# Altium project OECU_BASE.PrjPcb
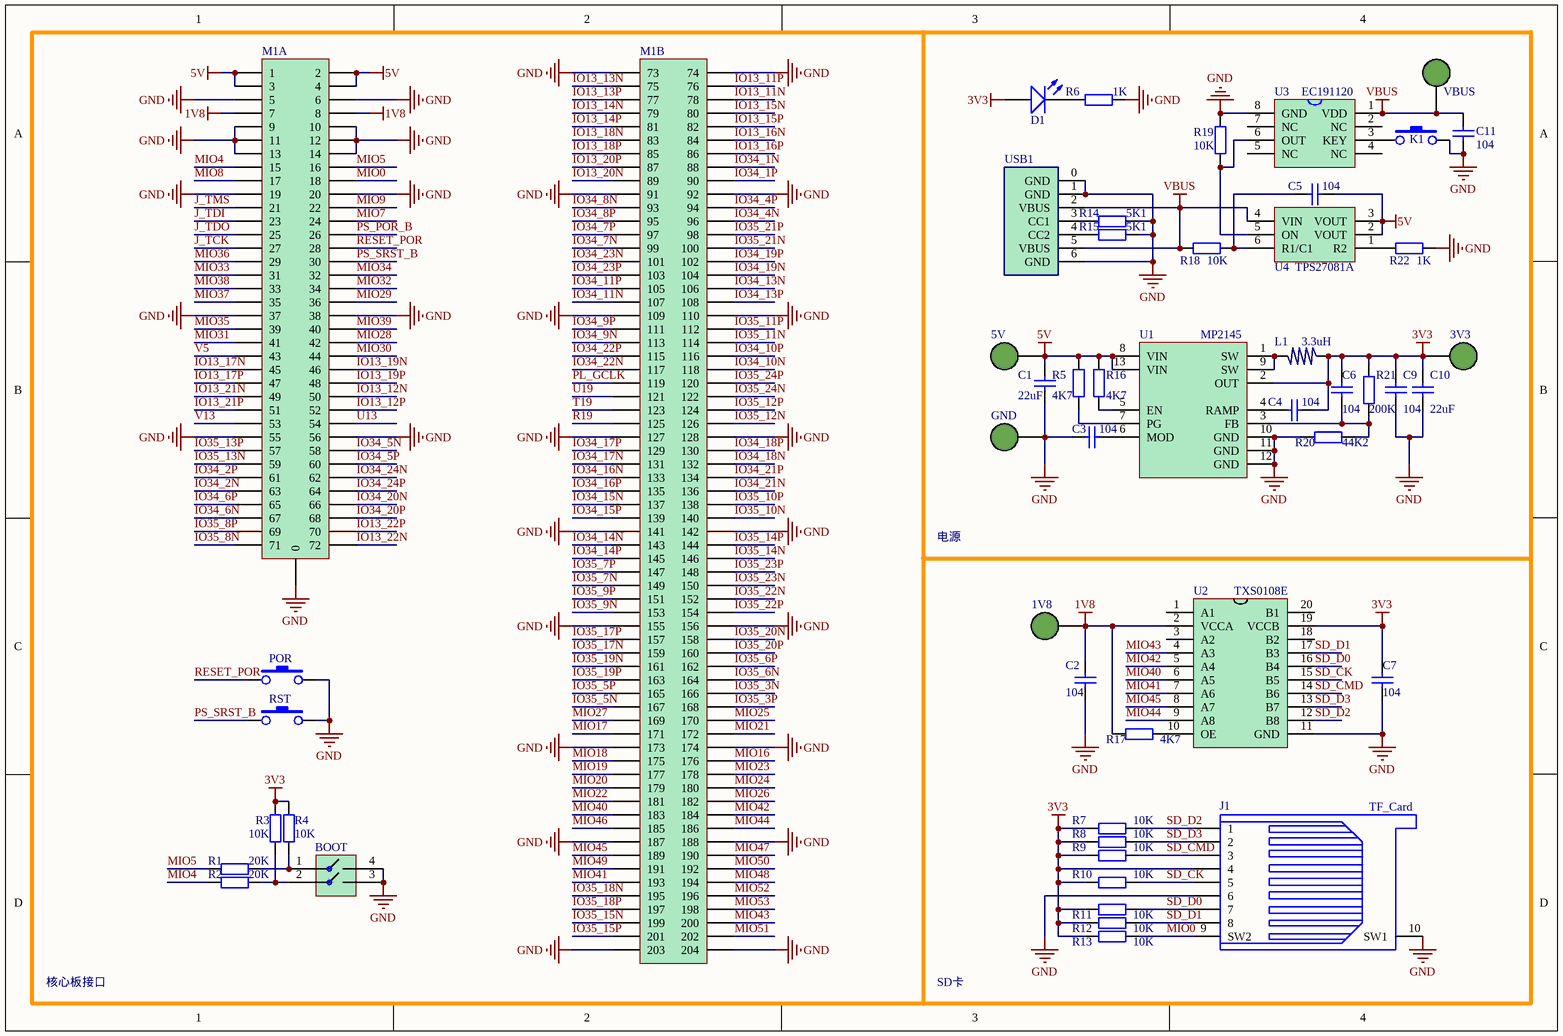
[diagram p0: OECU_BASE1.SchDoc]
6 sheets, 357 parts. Net scope: global (net labels, ports and power ports of the same name join across sheets).
Board file: OECU_BASE.PcbDoc
Sheets:
  OECU_BASE1.SchDoc
  OECU_BASE2.SchDoc
  OECU_BASE3.SchDoc
  OECU_BASE4.SchDoc
  OECU_BASE5.SchDoc
  OECU_BASE6.SchDoc

## Sheet OECU_BASE1.SchDoc
size A4; SheetNumber: 1; SheetTotal: 6

### Parts
1V8  TEST_POINT_2mm  [TEST_POINT_2mm]  (value not drawn)
3V3  TEST_POINT_2mm  [TEST_POINT_2mm]  (value not drawn)
5V  TEST_POINT_2mm  [TEST_POINT_2mm]  (value not drawn)
BOOT  DIP_SWITCH_2.54_2_SMD_S  [DIP_SWITCH_2.54_2_SMD_S]  (value not drawn)
C1  22uF  [1206]
C2  104  [0402]
C3  104  [0402]
C4  104  [0402]
C5  104  [0402]
C6  104  [0402]
C7  104  [0402]
C9  104  [0402]
C10  22uF  [1206]
C11  104  [0402]
D1  LED  [LED_0603]  (value not drawn)
GND  TEST_POINT_2mm  [TEST_POINT_2mm]  (value not drawn)
J1  TF_Card  [TF_card]
K1  KEY  [KEY_DIP_6_L]  (value not drawn)
L1  3.3uH  [L_0420]
M1  DDR3_204P_H8  [DDR3_204P_H8]  (value not drawn)  (parts A,B of 2)
POR  KEY  [KEY_DIP_6_L]  (value not drawn)
R1  20K  [R_0402]
R2  20K  [R_0402]
R3  10K  [R_0402]
R4  10K  [R_0402]
R5  4K7  [R_0402]
R6  1K  [R_0402]
R7  10K  [R_0402]
R8  10K  [R_0402]
R9  10K  [R_0402]
R10  10K  [R_0402]
R11  10K  [R_0402]
R12  10K  [R_0402]
R13  10K  [R_0402]
R14  5K1  [R_0402]
R15  5K1  [R_0402]
R16  4K7  [R_0402]
R17  4K7  [R_0402]
R18  10K  [R_0402]
R19  10K  [R_0402]
R20  44K2  [R_0402]
R21  200K  [R_0402]
R22  1K  [R_0402]
RST  KEY  [KEY_DIP_6_L]  (value not drawn)
U1  MP2145  [QFN12]
U2  TXS0108E  [TSSOP20]
U3  EC191120  [SOP8-150MIL]
U4  TPS27081A  [SOT_23_6]
USB1  USB_C_6P  [USB_C_6PIN]  (value not drawn)
VBUS  TEST_POINT_2mm  [TEST_POINT_2mm]  (value not drawn)

### Nets
1V8: 1V8.1 C2.2 M1.7 M1.8 R17.1 U2.2(VCCA)
3V3: 3V3.1 C4.2 C6.2 C7.2 C9.2 C10.2 D1.A J1.4 L1.1 R3.2 R4.2 R7.1 R8.1 R9.1 R10.1 R11.1 R12.1 R13.1 R21.2 U1.2(OUT) U2.19(VCCB)
5V: 5V.1 C1.2 C5.1 M1.1 M1.2 M1.3 M1.4 R5.2 R16.2 U1.8(VIN) U1.13(VIN) U4.2(VOUT) U4.3(VOUT)
GND: BOOT.3 BOOT.4 C1.1 C2.1 C3.2 C7.1 C9.1 C10.1 C11.2 GND.1 J1.6 J1.10(SW1) K1.1 M1.0 M1.5 M1.6 M1.9 M1.10 M1.11 M1.12 M1.13 M1.14 M1.19 M1.20 M1.37 M1.38 M1.55 M1.56 M1.73 M1.74 M1.91 M1.92 M1.109 M1.110 M1.127 M1.128 M1.141 M1.142 M1.155 M1.156 M1.173 M1.174 M1.187 M1.188 M1.203 M1.204 POR.1 R6.2 R14.1 R15.1 R19.2 R20.2 R22.2 RST.1 U1.10(GND) U1.11(GND) U1.12(GND) U2.11(GND) U3.8(GND) USB1.0(GND) USB1.1(GND) USB1.6(GND)
VBUS: C11.1 R18.2 U3.1(VDD) U4.4(VIN) USB1.2(VBUS) USB1.5(VBUS) VBUS.1
IO13_11N: M1.78
IO13_11P: M1.76
IO13_12N: M1.50
IO13_12P: M1.52
IO13_13N: M1.75
IO13_13P: M1.77
IO13_14N: M1.79
IO13_14P: M1.81
IO13_15N: M1.80
IO13_15P: M1.82
IO13_16N: M1.84
IO13_16P: M1.86
IO13_17N: M1.45
IO13_17P: M1.47
IO13_18N: M1.83
IO13_18P: M1.85
IO13_19N: M1.46
IO13_19P: M1.48
IO13_20N: M1.89
IO13_20P: M1.87
IO13_21N: M1.49
IO13_21P: M1.51
IO13_22N: M1.72
IO13_22P: M1.70
IO34_1N: M1.88
IO34_1P: M1.90
IO34_2N: M1.63
IO34_2P: M1.61
IO34_4N: M1.96
IO34_4P: M1.94
IO34_5N: M1.58
IO34_5P: M1.60
IO34_6N: M1.67
IO34_6P: M1.65
IO34_7N: M1.99
IO34_7P: M1.97
IO34_8N: M1.93
IO34_8P: M1.95
IO34_9N: M1.113
IO34_9P: M1.111
IO34_10N: M1.118
IO34_10P: M1.116
IO34_11N: M1.107
IO34_11P: M1.105
IO34_13N: M1.106
IO34_13P: M1.108
IO34_14N: M1.143
IO34_14P: M1.145
IO34_15N: M1.137
IO34_15P: M1.139
IO34_16N: M1.133
IO34_16P: M1.135
IO34_17N: M1.131
IO34_17P: M1.129
IO34_18N: M1.132
IO34_18P: M1.130
IO34_19N: M1.104
IO34_19P: M1.102
IO34_20N: M1.66
IO34_20P: M1.68
IO34_21N: M1.136
IO34_21P: M1.134
IO34_22N: M1.117
IO34_22P: M1.115
IO34_23N: M1.101
IO34_23P: M1.103
IO34_24N: M1.62
IO34_24P: M1.64
IO35_3N: M1.166
IO35_3P: M1.168
IO35_5N: M1.167
IO35_5P: M1.165
IO35_6N: M1.164
IO35_6P: M1.162
IO35_7N: M1.149
IO35_7P: M1.147
IO35_8N: M1.71
IO35_8P: M1.69
IO35_9N: M1.153
IO35_9P: M1.151
IO35_10N: M1.140
IO35_10P: M1.138
IO35_11N: M1.114
IO35_11P: M1.112
IO35_12N: M1.126
IO35_12P: M1.124
IO35_13N: M1.59
IO35_13P: M1.57
IO35_14N: M1.146
IO35_14P: M1.144
IO35_15N: M1.199
IO35_15P: M1.201
IO35_17N: M1.159
IO35_17P: M1.157
IO35_18N: M1.195
IO35_18P: M1.197
IO35_19N: M1.161
IO35_19P: M1.163
IO35_20N: M1.158
IO35_20P: M1.160
IO35_21N: M1.100
IO35_21P: M1.98
IO35_22N: M1.152
IO35_22P: M1.154
IO35_23N: M1.150
IO35_23P: M1.148
IO35_24N: M1.122
IO35_24P: M1.120
J_TCK: M1.27
J_TDI: M1.23
J_TDO: M1.25
J_TMS: M1.21
MIO0: J1.9(SW2) M1.18 R13.2
MIO4: M1.15 R2.2
MIO5: M1.16 R1.2
MIO7: M1.24
MIO8: M1.17
MIO9: M1.22
MIO16: M1.176
MIO17: M1.171
MIO18: M1.175
MIO19: M1.177
MIO20: M1.179
MIO21: M1.172
MIO22: M1.181
MIO23: M1.178
MIO24: M1.180
MIO25: M1.170
MIO26: M1.182
MIO27: M1.169
MIO28: M1.42
MIO29: M1.36
MIO30: M1.44
MIO31: M1.41
MIO32: M1.34
MIO33: M1.31
MIO34: M1.32
MIO35: M1.39
MIO36: M1.29
MIO37: M1.35
MIO38: M1.33
MIO39: M1.40
MIO40: M1.183 U2.6(A5)
MIO41: M1.193 U2.7(A6)
MIO42: M1.184 U2.5(A4)
MIO43: M1.200 U2.4(A3)
MIO44: M1.186 U2.9(A8)
MIO45: M1.189 U2.8(A7)
MIO46: M1.185
MIO47: M1.190
MIO48: M1.194
MIO49: M1.191
MIO50: M1.192
MIO51: M1.202
MIO52: M1.196
MIO53: M1.198
PL_GCLK: M1.119
PS_POR_B: M1.26
PS_SRST_B: M1.30 RST.2
R19: M1.125
RESET_POR: M1.28 POR.2
SD_CK: J1.5 R10.2 U2.15(B5)
SD_CMD: J1.3 R9.2 U2.14(B6)
SD_D0: J1.7 R11.2 U2.16(B4)
SD_D1: J1.8 R12.2 U2.17(B3)
SD_D2: J1.1 R7.2 U2.12(B8)
SD_D3: J1.2 R8.2 U2.13(B7)
T19: M1.123
U13: M1.54
U19: M1.121
V5: M1.43
V13: M1.53
NetBOOT_1: BOOT.1 R1.1 R4.1
NetBOOT_2: BOOT.2 R2.1 R3.1
NetC3_1: C3.1 U1.6(MOD)
NetC4_1: C4.1 U1.4(RAMP)
NetC5_2: C5.2 R18.1 U4.6(R1/C1)
NetC6_1: C6.1 R20.1 R21.1 U1.3(FB)
NetD1_K: D1.K R6.1
NetK1_2: K1.2 U3.3(KEY)
NetL1_2: L1.2 U1.1(SW) U1.9(SW)
NetR5_1: R5.1 U1.7(PG)
NetR14_2: R14.2 USB1.3(CC1)
NetR15_2: R15.2 USB1.4(CC2)
NetR16_1: R16.1 U1.5(EN)
NetR17_2: R17.2 U2.10(OE)
NetR19_1: R19.1 U3.6(OUT) U4.5(ON)
NetR22_1: R22.1 U4.1(R2)

Not connected (* = marked no-connect by the designer): U2 1(A1) 3(A2) 18(B2) 20(B1); U3 2(NC) 4(NC) 5(NC) 7(NC)

### Notes on the sheet
- 电源
- 核心板接口
- SD卡

### Library data of the parts
BOOT = DIP_SWITCH_2.54_2_SMD_S: 双路贴片立式拨码开关
C1 C10 = CAP_1206: 贴片电容 1206
C2-C7 C9 C11 = CAP_0402: 贴片电容 0402
D1 = LED_0603: LED 0603
J1 = TF_Card: TF卡座
K1 POR RST = KEY_DIP_6_L: 直插卧式按键 6mm
L1 = L_0420: 电感 0420
R1-R22 = RES_0402: 电阻 0402
U1 = MP2145: 5.5V, 6A, 1.2MHz
U3 = EC191120: 长按2秒开关机
U4 = TPS27081A: 高侧负载开关

## Sheet OECU_BASE2.SchDoc
size A4; SheetNumber: 2; SheetTotal: 6
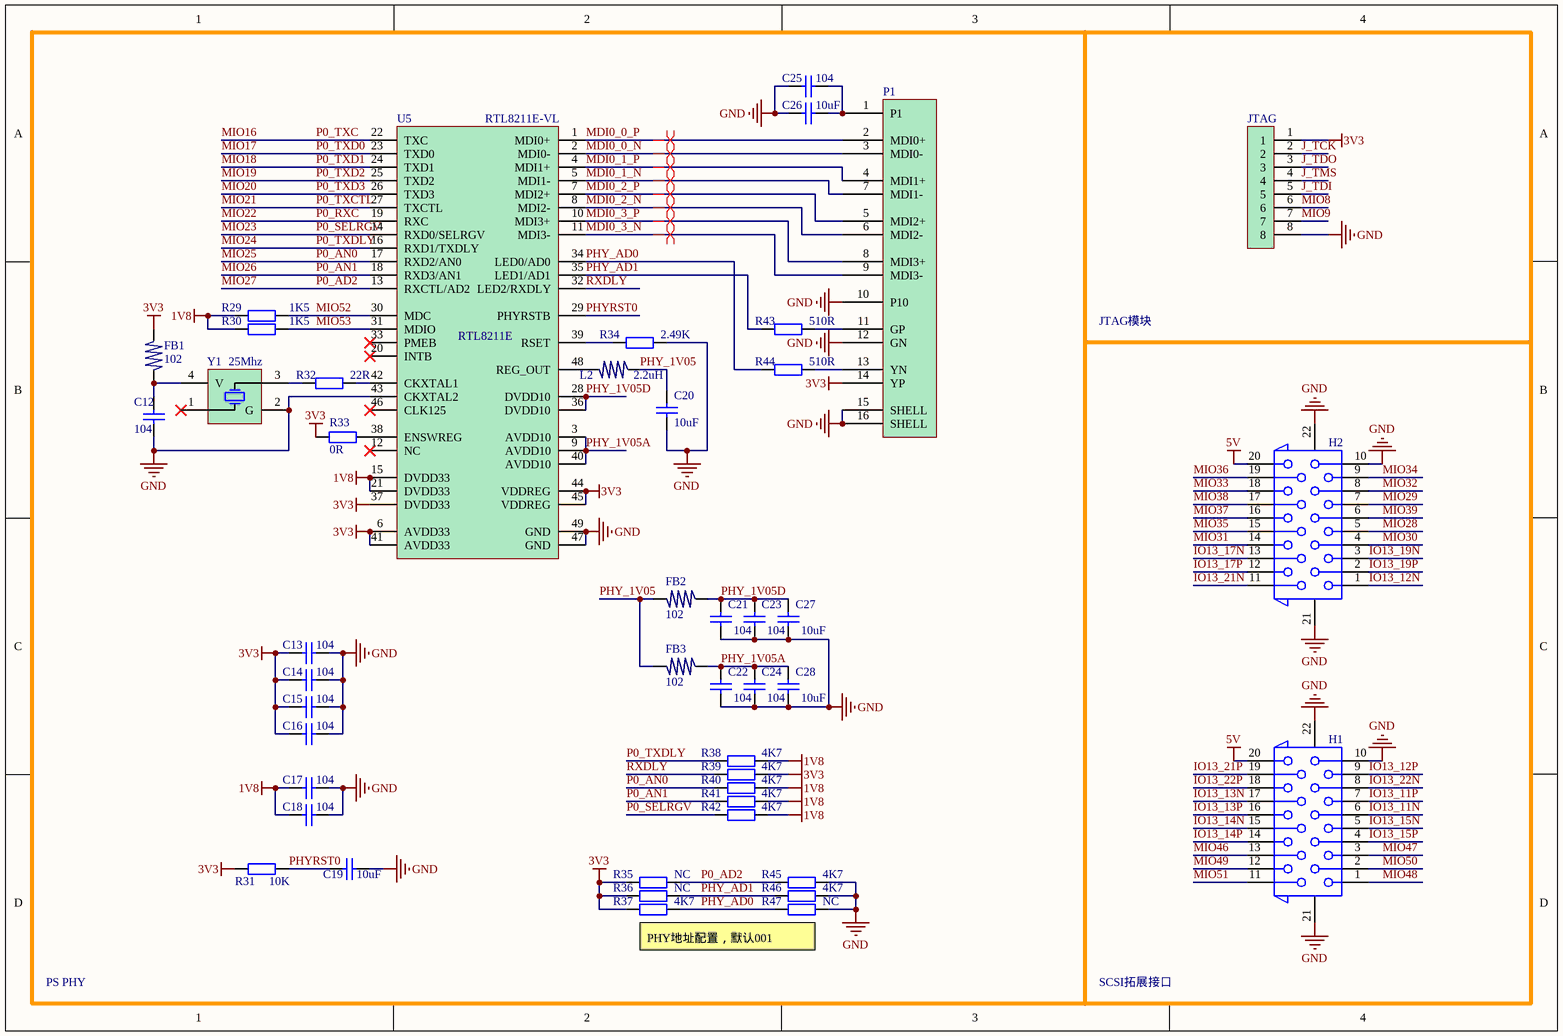
[diagram p1: OECU_BASE2.SchDoc]

### Parts
C12  104  [0402]
C13  104  [0402]
C14  104  [0402]
C15  104  [0402]
C16  104  [0402]
C17  104  [0402]
C18  104  [0402]
C19  10uF  [0402]
C20  10uF  [0402]
C21  104  [0402]
C22  104  [0402]
C23  104  [0402]
C24  104  [0402]
C25  104  [0402]
C26  10uF  [0402]
C27  10uF  [0402]
C28  10uF  [0402]
FB1  102  [0402]
FB2  102  [0603]
FB3  102  [0603]
H1  SCSI20_1  [SCSI20_1]  (value not drawn)
H2  SCSI20_1  [SCSI20_1]  (value not drawn)
JTAG  SH1.25mm_8P  [SH1.25MM_8P]  (value not drawn)
L2  2.2uH  [0805]
P1  RJ45  [HR911130A]  (value not drawn)
R29  1K5  [R_0402]
R30  1K5  [R_0402]
R31  10K  [R_0402]
R32  22R  [R_0402]
R33  0R  [R_0402]
R34  2.49K  [R_0402]
R35  NC  [R_0402]
R36  NC  [R_0402]
R37  4K7  [R_0402]
R38  4K7  [R_0402]
R39  4K7  [R_0402]
R40  4K7  [R_0402]
R41  4K7  [R_0402]
R42  4K7  [R_0402]
R43  510R  [R_0402]
R44  510R  [R_0402]
R45  4K7  [R_0402]
R46  4K7  [R_0402]
R47  NC  [R_0402]
U5  RTL8211E-VL  [QFN48]
Y1  25Mhz  [XTAL_3225]

### Nets
1V8: C17.1 C18.1 R29.2 R30.2 R38.2 R40.2 R41.2 R42.2 U5.15(DVDD33) U5.21(DVDD33)
3V3: C13.1 C14.1 C15.1 C16.1 FB1.2 JTAG.1 P1.14(YP) R31.1 R33.2 R35.1 R36.1 R37.1 R39.2 U5.6(AVDD33) U5.37(DVDD33) U5.41(AVDD33) U5.44(VDDREG) U5.45(VDDREG)
5V: H1.20 H2.20
GND: C12.1 C13.2 C14.2 C15.2 C16.2 C17.2 C18.2 C19.2 C20.1 C21.1 C22.1 C23.1 C24.1 C25.1 C26.1 C27.1 C28.1 H1.10 H1.21(SHELL) H1.22(SHELL) H2.10 H2.21(SHELL) H2.22(SHELL) JTAG.8 P1.10(P10) P1.12(GN) P1.15(SHELL) P1.16(SHELL) R34.2 R45.2 R46.2 R47.2 U5.43(CKXTAL2) U5.47(GND) U5.49(GND) Y1.2(G)
IO13_11N: H1.6
IO13_11P: H1.7
IO13_12N: H2.1
IO13_12P: H1.9
IO13_13N: H1.17
IO13_13P: H1.16
IO13_14N: H1.15
IO13_14P: H1.14
IO13_15N: H1.5
IO13_15P: H1.4
IO13_17N: H2.13
IO13_17P: H2.12
IO13_19N: H2.3
IO13_19P: H2.2
IO13_21N: H2.11
IO13_21P: H1.19
IO13_22N: H1.8
IO13_22P: H1.18
J_TCK: JTAG.2
J_TDI: JTAG.5
J_TDO: JTAG.3
J_TMS: JTAG.4
MDI0_0_N: P1.3(MDI0-) U5.2(MDI0-)
MDI0_0_P: P1.2(MDI0+) U5.1(MDI0+)
MDI0_1_N: P1.7(MDI1-) U5.5(MDI1-)
MDI0_1_P: P1.4(MDI1+) U5.4(MDI1+)
MDI0_2_N: P1.6(MDI2-) U5.8(MDI2-)
MDI0_2_P: P1.5(MDI2+) U5.7(MDI2+)
MDI0_3_N: P1.9(MDI3-) U5.11(MDI3-)
MDI0_3_P: P1.8(MDI3+) U5.10(MDI3+)
MIO8: JTAG.6
MIO9: JTAG.7
MIO16: U5.22(TXC)  [also labelled P0_TXC]
MIO17: U5.23(TXD0)  [also labelled P0_TXD0]
MIO18: U5.24(TXD1)  [also labelled P0_TXD1]
MIO19: U5.25(TXD2)  [also labelled P0_TXD2]
MIO20: U5.26(TXD3)  [also labelled P0_TXD3]
MIO21: U5.27(TXCTL)  [also labelled P0_TXCTL]
MIO22: U5.19(RXC)  [also labelled P0_RXC]
MIO23: R42.1 U5.14(RXD0/SELRGV)  [also labelled P0_SELRGV]
MIO24: R38.1 U5.16(RXD1/TXDLY)  [also labelled P0_TXDLY]
MIO25: R40.1 U5.17(RXD2/AN0)  [also labelled P0_AN0]
MIO26: R41.1 U5.18(RXD3/AN1)  [also labelled P0_AN1]
MIO27: R35.2 R45.1 U5.13(RXCTL/AD2)  [also labelled P0_AD2]
MIO28: H2.5
MIO29: H2.7
MIO30: H2.4
MIO31: H2.14
MIO32: H2.8
MIO33: H2.18
MIO34: H2.9
MIO35: H2.15
MIO36: H2.19
MIO37: H2.16
MIO38: H2.17
MIO39: H2.6
MIO46: H1.13
MIO47: H1.3
MIO48: H1.1
MIO49: H1.12
MIO50: H1.2
MIO51: H1.11
MIO52: R29.1 U5.30(MDC)
MIO53: R30.1 U5.31(MDIO)
PHY_1V05: C20.2 FB2.1 FB3.1 L2.1
PHY_1V05A: C22.2 C24.2 C28.2 FB3.2 U5.3(AVDD10) U5.9(AVDD10) U5.40(AVDD10)
PHY_1V05D: C21.2 C23.2 C27.2 FB2.2 U5.28(DVDD10) U5.36(DVDD10)
PHY_AD0: R37.2 R44.1 R47.1 U5.34(LED0/AD0)
PHY_AD1: R36.2 R43.1 R46.1 U5.35(LED1/AD1)
PHYRST0: C19.1 R31.2 U5.29(PHYRSTB)
RXDLY: R39.1 U5.32(LED2/RXDLY)
NetC12_2: C12.2 FB1.1 Y1.4(V)
NetC25_2: C25.2 C26.2 P1.1(P1)
NetL2_2: L2.2 U5.48(REG_OUT)
NetP1_11: P1.11(GP) R43.2
NetP1_13: P1.13(YN) R44.2
NetR32_1: R32.1 U5.42(CKXTAL1)
NetR32_2: R32.2 Y1.3(OP)
NetR33_1: R33.1 U5.38(ENSWREG)
NetR34_1: R34.1 U5.39(RSET)

Not connected (* = marked no-connect by the designer): U5 12(NC)* 20(INTB)* 33(PMEB)* 46(CLK125)*; Y1 1(EC)*

### Layout directives
differential pair: MDI0_0_N, MDI0_0_P, MDI0_1_N, MDI0_1_P, MDI0_2_N, MDI0_2_P, MDI0_3_N, MDI0_3_P

### Notes on the sheet
- JTAG模块
- PS PHY
- PHY地址配置，默认001
- SCSI拓展接口

### Library data of the parts
C12-C28 = CAP_0402: 贴片电容 0402
FB1 = FB_0402: 磁珠 0402
FB2 FB3 = FB_0603: 磁珠 0603
L2 = L_0805: 电感 0805
P1 = RJ45_HR911130A
R29-R47 = RES_0402: 电阻 0402
U5 = RTL8211E: QFN48
Y1 = XTAL_3225: 贴片有源晶振

## Sheet OECU_BASE3.SchDoc
size A4; SheetNumber: 3; SheetTotal: 6
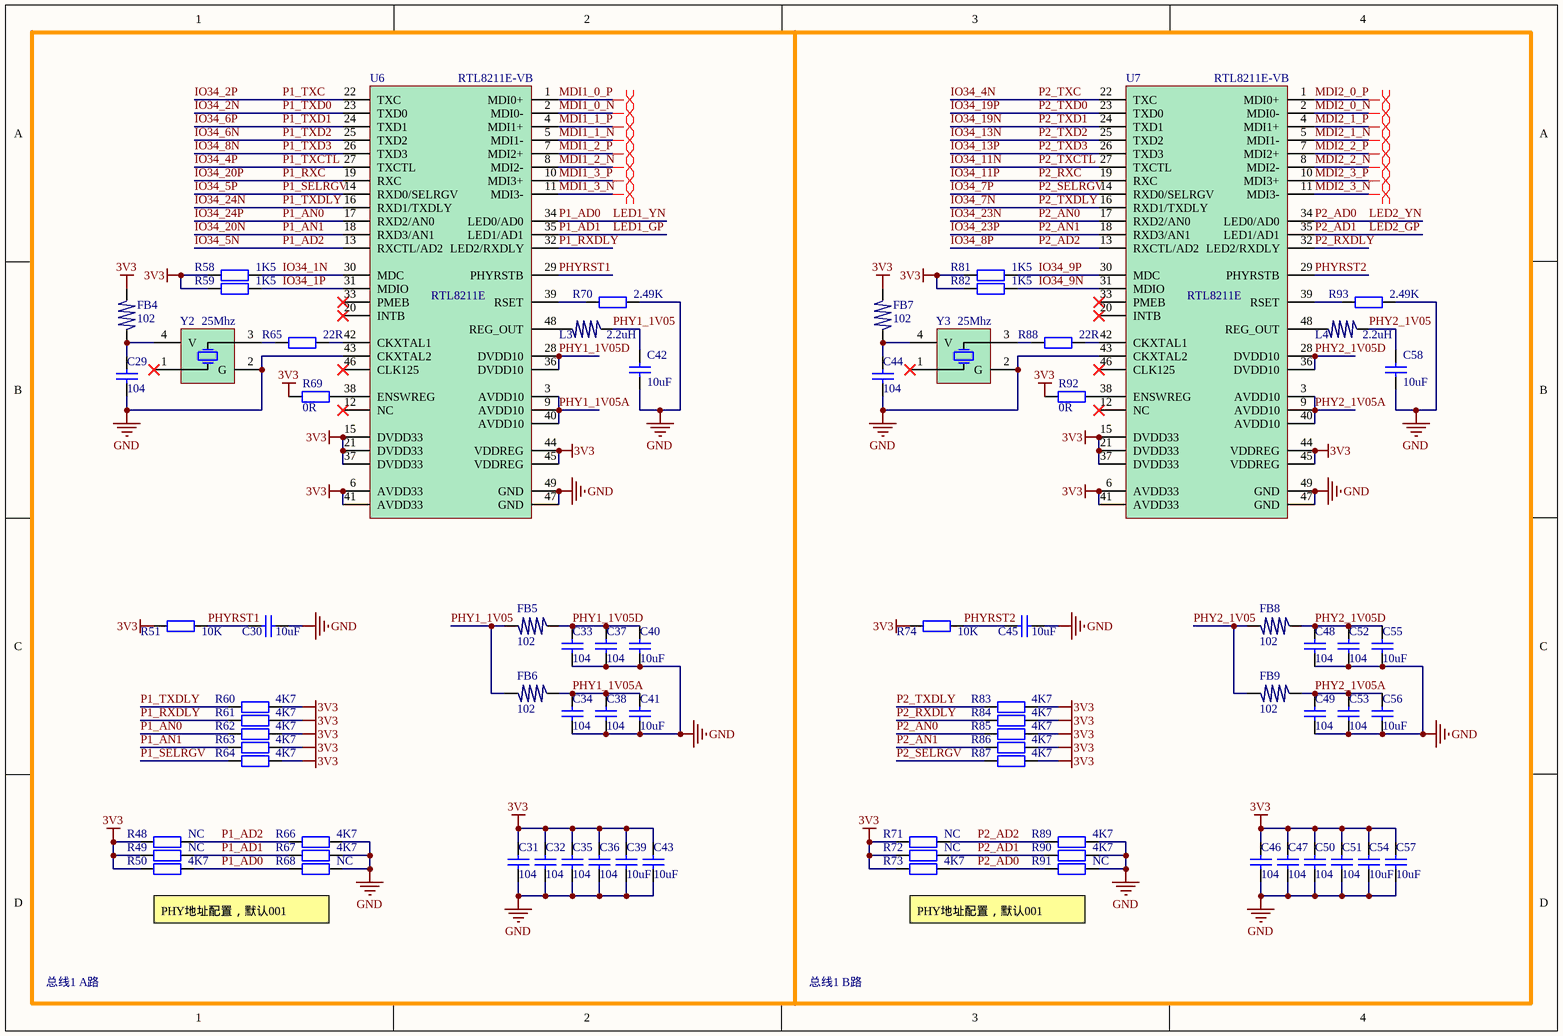
[diagram p2: OECU_BASE3.SchDoc]

### Parts
C29  104  [0402]
C30  10uF  [0402]
C31  104  [0402]
C32  104  [0402]
C33  104  [0402]
C34  104  [0402]
C35  104  [0402]
C36  104  [0402]
C37  104  [0402]
C38  104  [0402]
C39  10uF  [0402]
C40  10uF  [0402]
C41  10uF  [0402]
C42  10uF  [0402]
C43  10uF  [0402]
C44  104  [0402]
C45  10uF  [0402]
C46  104  [0402]
C47  104  [0402]
C48  104  [0402]
C49  104  [0402]
C50  104  [0402]
C51  104  [0402]
C52  104  [0402]
C53  104  [0402]
C54  10uF  [0402]
C55  10uF  [0402]
C56  10uF  [0402]
C57  10uF  [0402]
C58  10uF  [0402]
FB4  102  [0402]
FB5  102  [0603]
FB6  102  [0603]
FB7  102  [0402]
FB8  102  [0603]
FB9  102  [0603]
L3  2.2uH  [0805]
L4  2.2uH  [0805]
R48  NC  [R_0402]
R49  NC  [R_0402]
R50  4K7  [R_0402]
R51  10K  [R_0402]
R58  1K5  [R_0402]
R59  1K5  [R_0402]
R60  4K7  [R_0402]
R61  4K7  [R_0402]
R62  4K7  [R_0402]
R63  4K7  [R_0402]
R64  4K7  [R_0402]
R65  22R  [R_0402]
R66  4K7  [R_0402]
R67  4K7  [R_0402]
R68  NC  [R_0402]
R69  0R  [R_0402]
R70  2.49K  [R_0402]
R71  NC  [R_0402]
R72  NC  [R_0402]
R73  4K7  [R_0402]
R74  10K  [R_0402]
R81  1K5  [R_0402]
R82  1K5  [R_0402]
R83  4K7  [R_0402]
R84  4K7  [R_0402]
R85  4K7  [R_0402]
R86  4K7  [R_0402]
R87  4K7  [R_0402]
R88  22R  [R_0402]
R89  4K7  [R_0402]
R90  4K7  [R_0402]
R91  NC  [R_0402]
R92  0R  [R_0402]
R93  2.49K  [R_0402]
U6  RTL8211E-VB  [QFN48]
U7  RTL8211E-VB  [QFN48]
Y2  25Mhz  [XTAL_3225]
Y3  25Mhz  [XTAL_3225]

### Nets
3V3: C31.1 C32.1 C35.1 C36.1 C39.1 C43.1 C46.1 C47.1 C50.1 C51.1 C54.1 C57.1 FB4.2 FB7.2 R48.1 R49.1 R50.1 R51.1 R58.2 R59.2 R60.2 R61.2 R62.2 R63.2 R64.2 R69.2 R71.1 R72.1 R73.1 R74.1 R81.2 R82.2 R83.2 R84.2 R85.2 R86.2 R87.2 R92.2 U6.6(AVDD33) U6.15(DVDD33) U6.21(DVDD33) U6.37(DVDD33) U6.41(AVDD33) U6.44(VDDREG) U6.45(VDDREG) U7.6(AVDD33) U7.15(DVDD33) U7.21(DVDD33) U7.37(DVDD33) U7.41(AVDD33) U7.44(VDDREG) U7.45(VDDREG)
GND: C29.1 C30.2 C31.2 C32.2 C33.1 C34.1 C35.2 C36.2 C37.1 C38.1 C39.2 C40.1 C41.1 C42.1 C43.2 C44.1 C45.2 C46.2 C47.2 C48.1 C49.1 C50.2 C51.2 C52.1 C53.1 C54.2 C55.1 C56.1 C57.2 C58.1 R66.2 R67.2 R68.2 R70.2 R89.2 R90.2 R91.2 R93.2 U6.43(CKXTAL2) U6.47(GND) U6.49(GND) U7.43(CKXTAL2) U7.47(GND) U7.49(GND) Y2.2(G) Y3.2(G)
IO34_1N: R58.1 U6.30(MDC)
IO34_1P: R59.1 U6.31(MDIO)
IO34_2N: U6.23(TXD0)  [also labelled P1_TXD0]
IO34_2P: U6.22(TXC)  [also labelled P1_TXC]
IO34_4N: U7.22(TXC)  [also labelled P2_TXC]
IO34_4P: U6.27(TXCTL)  [also labelled P1_TXCTL]
IO34_5N: R48.2 R66.1 U6.13(RXCTL/AD2)  [also labelled P1_AD2]
IO34_5P: R64.1 U6.14(RXD0/SELRGV)  [also labelled P1_SELRGV]
IO34_6N: U6.25(TXD2)  [also labelled P1_TXD2]
IO34_6P: U6.24(TXD1)  [also labelled P1_TXD1]
IO34_7N: R83.1 U7.16(RXD1/TXDLY)  [also labelled P2_TXDLY]
IO34_7P: R87.1 U7.14(RXD0/SELRGV)  [also labelled P2_SELRGV]
IO34_8N: U6.26(TXD3)  [also labelled P1_TXD3]
IO34_8P: R71.2 R89.1 U7.13(RXCTL/AD2)  [also labelled P2_AD2]
IO34_9N: R82.1 U7.31(MDIO)
IO34_9P: R81.1 U7.30(MDC)
IO34_11N: U7.27(TXCTL)  [also labelled P2_TXCTL]
IO34_11P: U7.19(RXC)  [also labelled P2_RXC]
IO34_13N: U7.25(TXD2)  [also labelled P2_TXD2]
IO34_13P: U7.26(TXD3)  [also labelled P2_TXD3]
IO34_19N: U7.24(TXD1)  [also labelled P2_TXD1]
IO34_19P: U7.23(TXD0)  [also labelled P2_TXD0]
IO34_20N: R63.1 U6.18(RXD3/AN1)  [also labelled P1_AN1]
IO34_20P: U6.19(RXC)  [also labelled P1_RXC]
IO34_23N: R85.1 U7.17(RXD2/AN0)  [also labelled P2_AN0]
IO34_23P: R86.1 U7.18(RXD3/AN1)  [also labelled P2_AN1]
IO34_24N: R60.1 U6.16(RXD1/TXDLY)  [also labelled P1_TXDLY]
IO34_24P: R62.1 U6.17(RXD2/AN0)  [also labelled P1_AN0]
LED1_GP: R49.2 R67.1 U6.35(LED1/AD1)  [also labelled P1_AD1]
LED1_YN: R50.2 R68.1 U6.34(LED0/AD0)  [also labelled P1_AD0]
LED2_GP: R72.2 R90.1 U7.35(LED1/AD1)  [also labelled P2_AD1]
LED2_YN: R73.2 R91.1 U7.34(LED0/AD0)  [also labelled P2_AD0]
MDI1_0_N: U6.2(MDI0-)
MDI1_0_P: U6.1(MDI0+)
MDI1_1_N: U6.5(MDI1-)
MDI1_1_P: U6.4(MDI1+)
MDI1_2_N: U6.8(MDI2-)
MDI1_2_P: U6.7(MDI2+)
MDI1_3_N: U6.11(MDI3-)
MDI1_3_P: U6.10(MDI3+)
MDI2_0_N: U7.2(MDI0-)
MDI2_0_P: U7.1(MDI0+)
MDI2_1_N: U7.5(MDI1-)
MDI2_1_P: U7.4(MDI1+)
MDI2_2_N: U7.8(MDI2-)
MDI2_2_P: U7.7(MDI2+)
MDI2_3_N: U7.11(MDI3-)
MDI2_3_P: U7.10(MDI3+)
P1_RXDLY: R61.1 U6.32(LED2/RXDLY)
P2_RXDLY: R84.1 U7.32(LED2/RXDLY)
PHY1_1V05: C42.2 FB5.1 FB6.1 L3.1
PHY1_1V05A: C34.2 C38.2 C41.2 FB6.2 U6.3(AVDD10) U6.9(AVDD10) U6.40(AVDD10)
PHY1_1V05D: C33.2 C37.2 C40.2 FB5.2 U6.28(DVDD10) U6.36(DVDD10)
PHY2_1V05: C58.2 FB8.1 FB9.1 L4.1
PHY2_1V05A: C49.2 C53.2 C56.2 FB9.2 U7.3(AVDD10) U7.9(AVDD10) U7.40(AVDD10)
PHY2_1V05D: C48.2 C52.2 C55.2 FB8.2 U7.28(DVDD10) U7.36(DVDD10)
PHYRST1: C30.1 R51.2 U6.29(PHYRSTB)
PHYRST2: C45.1 R74.2 U7.29(PHYRSTB)
NetC29_2: C29.2 FB4.1 Y2.4(V)
NetC44_2: C44.2 FB7.1 Y3.4(V)
NetL3_2: L3.2 U6.48(REG_OUT)
NetL4_2: L4.2 U7.48(REG_OUT)
NetR65_1: R65.1 U6.42(CKXTAL1)
NetR65_2: R65.2 Y2.3(OP)
NetR69_1: R69.1 U6.38(ENSWREG)
NetR70_1: R70.1 U6.39(RSET)
NetR88_1: R88.1 U7.42(CKXTAL1)
NetR88_2: R88.2 Y3.3(OP)
NetR92_1: R92.1 U7.38(ENSWREG)
NetR93_1: R93.1 U7.39(RSET)

Not connected (* = marked no-connect by the designer): U6 12(NC)* 20(INTB)* 33(PMEB)* 46(CLK125)*; U7 12(NC)* 20(INTB)* 33(PMEB)* 46(CLK125)*; Y2 1(EC)*; Y3 1(EC)*

### Layout directives
differential pair: MDI1_0_N, MDI1_0_P, MDI1_1_N, MDI1_1_P, MDI1_2_N, MDI1_2_P, MDI1_3_N, MDI1_3_P, MDI2_0_N, MDI2_0_P, MDI2_1_N, MDI2_1_P, MDI2_2_N, MDI2_2_P, MDI2_3_N, MDI2_3_P

### Notes on the sheet
- PHY地址配置，默认001
- 总线1 A路
- 总线1 B路

### Library data of the parts
C29-C58 = CAP_0402: 贴片电容 0402
FB4 FB7 = FB_0402: 磁珠 0402
FB5 FB6 FB8 FB9 = FB_0603: 磁珠 0603
L3 L4 = L_0805: 电感 0805
R48-R51 R58-R74 R81-R93 = RES_0402: 电阻 0402
U6 U7 = RTL8211E: QFN48
Y2 Y3 = XTAL_3225

## Sheet OECU_BASE4.SchDoc
size A4; SheetNumber: 4; SheetTotal: 6
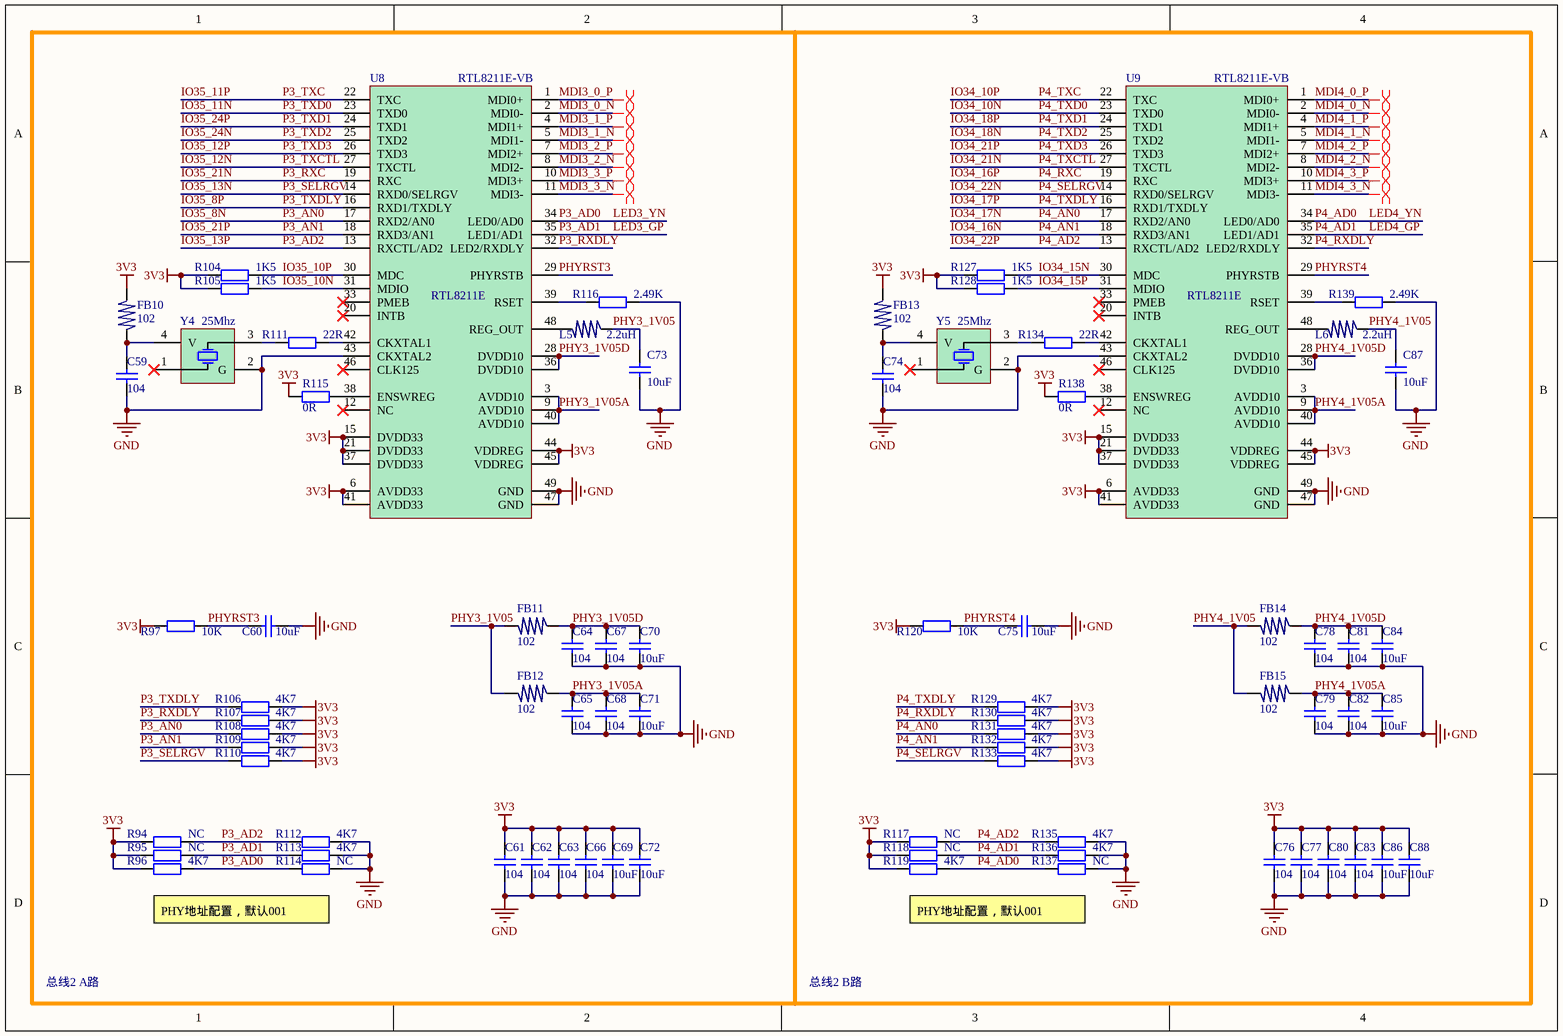
[diagram p3: OECU_BASE4.SchDoc]

### Parts
C59  104  [0402]
C60  10uF  [0402]
C61  104  [0402]
C62  104  [0402]
C63  104  [0402]
C64  104  [0402]
C65  104  [0402]
C66  104  [0402]
C67  104  [0402]
C68  104  [0402]
C69  10uF  [0402]
C70  10uF  [0402]
C71  10uF  [0402]
C72  10uF  [0402]
C73  10uF  [0402]
C74  104  [0402]
C75  10uF  [0402]
C76  104  [0402]
C77  104  [0402]
C78  104  [0402]
C79  104  [0402]
C80  104  [0402]
C81  104  [0402]
C82  104  [0402]
C83  104  [0402]
C84  10uF  [0402]
C85  10uF  [0402]
C86  10uF  [0402]
C87  10uF  [0402]
C88  10uF  [0402]
FB10  102  [0402]
FB11  102  [0603]
FB12  102  [0603]
FB13  102  [0402]
FB14  102  [0603]
FB15  102  [0603]
L5  2.2uH  [0805]
L6  2.2uH  [0805]
R94  NC  [R_0402]
R95  NC  [R_0402]
R96  4K7  [R_0402]
R97  10K  [R_0402]
R104  1K5  [R_0402]
R105  1K5  [R_0402]
R106  4K7  [R_0402]
R107  4K7  [R_0402]
R108  4K7  [R_0402]
R109  4K7  [R_0402]
R110  4K7  [R_0402]
R111  22R  [R_0402]
R112  4K7  [R_0402]
R113  4K7  [R_0402]
R114  NC  [R_0402]
R115  0R  [R_0402]
R116  2.49K  [R_0402]
R117  NC  [R_0402]
R118  NC  [R_0402]
R119  4K7  [R_0402]
R120  10K  [R_0402]
R127  1K5  [R_0402]
R128  1K5  [R_0402]
R129  4K7  [R_0402]
R130  4K7  [R_0402]
R131  4K7  [R_0402]
R132  4K7  [R_0402]
R133  4K7  [R_0402]
R134  22R  [R_0402]
R135  4K7  [R_0402]
R136  4K7  [R_0402]
R137  NC  [R_0402]
R138  0R  [R_0402]
R139  2.49K  [R_0402]
U8  RTL8211E-VB  [QFN48]
U9  RTL8211E-VB  [QFN48]
Y4  25Mhz  [XTAL_3225]
Y5  25Mhz  [XTAL_3225]

### Nets
3V3: C61.1 C62.1 C63.1 C66.1 C69.1 C72.1 C76.1 C77.1 C80.1 C83.1 C86.1 C88.1 FB10.2 FB13.2 R94.1 R95.1 R96.1 R97.1 R104.2 R105.2 R106.2 R107.2 R108.2 R109.2 R110.2 R115.2 R117.1 R118.1 R119.1 R120.1 R127.2 R128.2 R129.2 R130.2 R131.2 R132.2 R133.2 R138.2 U8.6(AVDD33) U8.15(DVDD33) U8.21(DVDD33) U8.37(DVDD33) U8.41(AVDD33) U8.44(VDDREG) U8.45(VDDREG) U9.6(AVDD33) U9.15(DVDD33) U9.21(DVDD33) U9.37(DVDD33) U9.41(AVDD33) U9.44(VDDREG) U9.45(VDDREG)
GND: C59.1 C60.2 C61.2 C62.2 C63.2 C64.1 C65.1 C66.2 C67.1 C68.1 C69.2 C70.1 C71.1 C72.2 C73.1 C74.1 C75.2 C76.2 C77.2 C78.1 C79.1 C80.2 C81.1 C82.1 C83.2 C84.1 C85.1 C86.2 C87.1 C88.2 R112.2 R113.2 R114.2 R116.2 R135.2 R136.2 R137.2 R139.2 U8.43(CKXTAL2) U8.47(GND) U8.49(GND) U9.43(CKXTAL2) U9.47(GND) U9.49(GND) Y4.2(G) Y5.2(G)
IO34_10N: U9.23(TXD0)  [also labelled P4_TXD0]
IO34_10P: U9.22(TXC)  [also labelled P4_TXC]
IO34_15N: R127.1 U9.30(MDC)
IO34_15P: R128.1 U9.31(MDIO)
IO34_16N: R132.1 U9.18(RXD3/AN1)  [also labelled P4_AN1]
IO34_16P: U9.19(RXC)  [also labelled P4_RXC]
IO34_17N: R131.1 U9.17(RXD2/AN0)  [also labelled P4_AN0]
IO34_17P: R129.1 U9.16(RXD1/TXDLY)  [also labelled P4_TXDLY]
IO34_18N: U9.25(TXD2)  [also labelled P4_TXD2]
IO34_18P: U9.24(TXD1)  [also labelled P4_TXD1]
IO34_21N: U9.27(TXCTL)  [also labelled P4_TXCTL]
IO34_21P: U9.26(TXD3)  [also labelled P4_TXD3]
IO34_22N: R133.1 U9.14(RXD0/SELRGV)  [also labelled P4_SELRGV]
IO34_22P: R117.2 R135.1 U9.13(RXCTL/AD2)  [also labelled P4_AD2]
IO35_8N: R108.1 U8.17(RXD2/AN0)  [also labelled P3_AN0]
IO35_8P: R106.1 U8.16(RXD1/TXDLY)  [also labelled P3_TXDLY]
IO35_10N: R105.1 U8.31(MDIO)
IO35_10P: R104.1 U8.30(MDC)
IO35_11N: U8.23(TXD0)  [also labelled P3_TXD0]
IO35_11P: U8.22(TXC)  [also labelled P3_TXC]
IO35_12N: U8.27(TXCTL)  [also labelled P3_TXCTL]
IO35_12P: U8.26(TXD3)  [also labelled P3_TXD3]
IO35_13N: R110.1 U8.14(RXD0/SELRGV)  [also labelled P3_SELRGV]
IO35_13P: R94.2 R112.1 U8.13(RXCTL/AD2)  [also labelled P3_AD2]
IO35_21N: U8.19(RXC)  [also labelled P3_RXC]
IO35_21P: R109.1 U8.18(RXD3/AN1)  [also labelled P3_AN1]
IO35_24N: U8.25(TXD2)  [also labelled P3_TXD2]
IO35_24P: U8.24(TXD1)  [also labelled P3_TXD1]
LED3_GP: R95.2 R113.1 U8.35(LED1/AD1)  [also labelled P3_AD1]
LED3_YN: R96.2 R114.1 U8.34(LED0/AD0)  [also labelled P3_AD0]
LED4_GP: R118.2 R136.1 U9.35(LED1/AD1)  [also labelled P4_AD1]
LED4_YN: R119.2 R137.1 U9.34(LED0/AD0)  [also labelled P4_AD0]
MDI3_0_N: U8.2(MDI0-)
MDI3_0_P: U8.1(MDI0+)
MDI3_1_N: U8.5(MDI1-)
MDI3_1_P: U8.4(MDI1+)
MDI3_2_N: U8.8(MDI2-)
MDI3_2_P: U8.7(MDI2+)
MDI3_3_N: U8.11(MDI3-)
MDI3_3_P: U8.10(MDI3+)
MDI4_0_N: U9.2(MDI0-)
MDI4_0_P: U9.1(MDI0+)
MDI4_1_N: U9.5(MDI1-)
MDI4_1_P: U9.4(MDI1+)
MDI4_2_N: U9.8(MDI2-)
MDI4_2_P: U9.7(MDI2+)
MDI4_3_N: U9.11(MDI3-)
MDI4_3_P: U9.10(MDI3+)
P3_RXDLY: R107.1 U8.32(LED2/RXDLY)
P4_RXDLY: R130.1 U9.32(LED2/RXDLY)
PHY3_1V05: C73.2 FB11.1 FB12.1 L5.1
PHY3_1V05A: C65.2 C68.2 C71.2 FB12.2 U8.3(AVDD10) U8.9(AVDD10) U8.40(AVDD10)
PHY3_1V05D: C64.2 C67.2 C70.2 FB11.2 U8.28(DVDD10) U8.36(DVDD10)
PHY4_1V05: C87.2 FB14.1 FB15.1 L6.1
PHY4_1V05A: C79.2 C82.2 C85.2 FB15.2 U9.3(AVDD10) U9.9(AVDD10) U9.40(AVDD10)
PHY4_1V05D: C78.2 C81.2 C84.2 FB14.2 U9.28(DVDD10) U9.36(DVDD10)
PHYRST3: C60.1 R97.2 U8.29(PHYRSTB)
PHYRST4: C75.1 R120.2 U9.29(PHYRSTB)
NetC59_2: C59.2 FB10.1 Y4.4(V)
NetC74_2: C74.2 FB13.1 Y5.4(V)
NetL5_2: L5.2 U8.48(REG_OUT)
NetL6_2: L6.2 U9.48(REG_OUT)
NetR111_1: R111.1 U8.42(CKXTAL1)
NetR111_2: R111.2 Y4.3(OP)
NetR115_1: R115.1 U8.38(ENSWREG)
NetR116_1: R116.1 U8.39(RSET)
NetR134_1: R134.1 U9.42(CKXTAL1)
NetR134_2: R134.2 Y5.3(OP)
NetR138_1: R138.1 U9.38(ENSWREG)
NetR139_1: R139.1 U9.39(RSET)

Not connected (* = marked no-connect by the designer): U8 12(NC)* 20(INTB)* 33(PMEB)* 46(CLK125)*; U9 12(NC)* 20(INTB)* 33(PMEB)* 46(CLK125)*; Y4 1(EC)*; Y5 1(EC)*

### Layout directives
differential pair: MDI3_0_N, MDI3_0_P, MDI3_1_N, MDI3_1_P, MDI3_2_N, MDI3_2_P, MDI3_3_N, MDI3_3_P, MDI4_0_N, MDI4_0_P, MDI4_1_N, MDI4_1_P, MDI4_2_N, MDI4_2_P, MDI4_3_N, MDI4_3_P

### Notes on the sheet
- PHY地址配置，默认001
- 总线2 A路
- 总线2 B路

### Library data of the parts
C59-C88 = CAP_0402: 贴片电容 0402
FB10 FB13 = FB_0402: 磁珠 0402
FB11 FB12 FB14 FB15 = FB_0603: 磁珠 0603
L5 L6 = L_0805: 电感 0805
R94-R97 R104-R120 R127-R139 = RES_0402: 电阻 0402
U8 U9 = RTL8211E: QFN48
Y4 Y5 = XTAL_3225

## Sheet OECU_BASE5.SchDoc
size A4; SheetNumber: 5; SheetTotal: 6
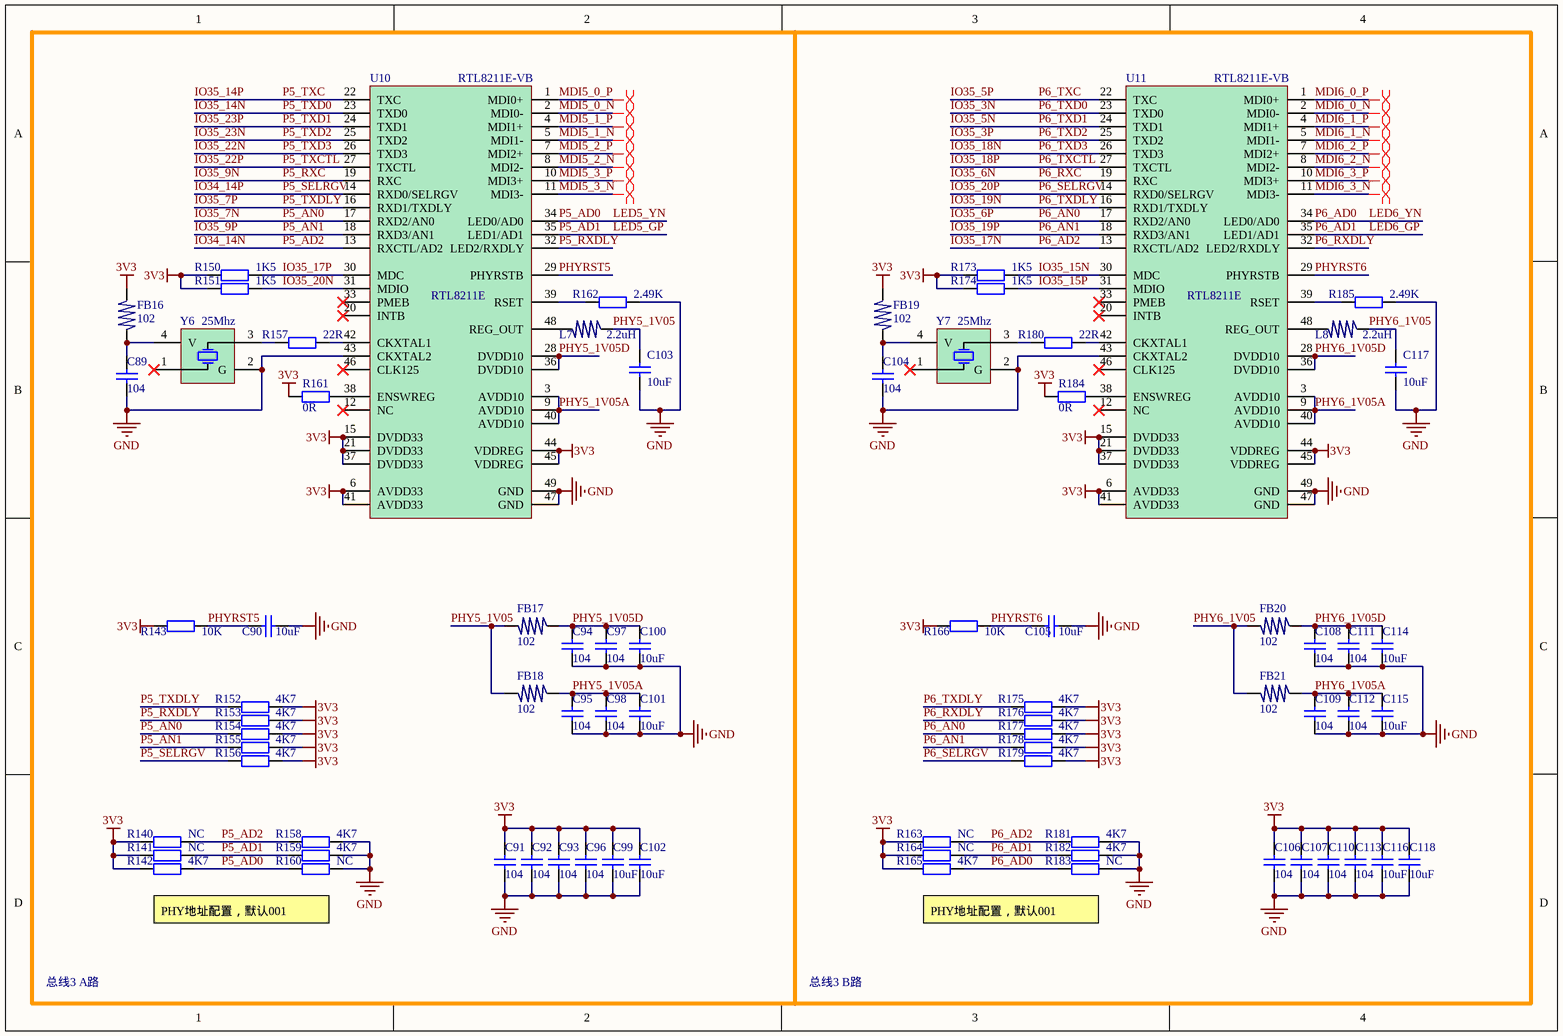
[diagram p4: OECU_BASE5.SchDoc]

### Parts
C89  104  [0402]
C90  10uF  [0402]
C91  104  [0402]
C92  104  [0402]
C93  104  [0402]
C94  104  [0402]
C95  104  [0402]
C96  104  [0402]
C97  104  [0402]
C98  104  [0402]
C99  10uF  [0402]
C100  10uF  [0402]
C101  10uF  [0402]
C102  10uF  [0402]
C103  10uF  [0402]
C104  104  [0402]
C105  10uF  [0402]
C106  104  [0402]
C107  104  [0402]
C108  104  [0402]
C109  104  [0402]
C110  104  [0402]
C111  104  [0402]
C112  104  [0402]
C113  104  [0402]
C114  10uF  [0402]
C115  10uF  [0402]
C116  10uF  [0402]
C117  10uF  [0402]
C118  10uF  [0402]
FB16  102  [0402]
FB17  102  [0603]
FB18  102  [0603]
FB19  102  [0402]
FB20  102  [0603]
FB21  102  [0603]
L7  2.2uH  [0805]
L8  2.2uH  [0805]
R140  NC  [R_0402]
R141  NC  [R_0402]
R142  4K7  [R_0402]
R143  10K  [R_0402]
R150  1K5  [R_0402]
R151  1K5  [R_0402]
R152  4K7  [R_0402]
R153  4K7  [R_0402]
R154  4K7  [R_0402]
R155  4K7  [R_0402]
R156  4K7  [R_0402]
R157  22R  [R_0402]
R158  4K7  [R_0402]
R159  4K7  [R_0402]
R160  NC  [R_0402]
R161  0R  [R_0402]
R162  2.49K  [R_0402]
R163  NC  [R_0402]
R164  NC  [R_0402]
R165  4K7  [R_0402]
R166  10K  [R_0402]
R173  1K5  [R_0402]
R174  1K5  [R_0402]
R175  4K7  [R_0402]
R176  4K7  [R_0402]
R177  4K7  [R_0402]
R178  4K7  [R_0402]
R179  4K7  [R_0402]
R180  22R  [R_0402]
R181  4K7  [R_0402]
R182  4K7  [R_0402]
R183  NC  [R_0402]
R184  0R  [R_0402]
R185  2.49K  [R_0402]
U10  RTL8211E-VB  [QFN48]
U11  RTL8211E-VB  [QFN48]
Y6  25Mhz  [XTAL_3225]
Y7  25Mhz  [XTAL_3225]

### Nets
3V3: C91.1 C92.1 C93.1 C96.1 C99.1 C102.1 C106.1 C107.1 C110.1 C113.1 C116.1 C118.1 FB16.2 FB19.2 R140.1 R141.1 R142.1 R143.1 R150.2 R151.2 R152.2 R153.2 R154.2 R155.2 R156.2 R161.2 R163.1 R164.1 R165.1 R166.1 R173.2 R174.2 R175.2 R176.2 R177.2 R178.2 R179.2 R184.2 U10.6(AVDD33) U10.15(DVDD33) U10.21(DVDD33) U10.37(DVDD33) U10.41(AVDD33) U10.44(VDDREG) U10.45(VDDREG) U11.6(AVDD33) U11.15(DVDD33) U11.21(DVDD33) U11.37(DVDD33) U11.41(AVDD33) U11.44(VDDREG) U11.45(VDDREG)
GND: C89.1 C90.2 C91.2 C92.2 C93.2 C94.1 C95.1 C96.2 C97.1 C98.1 C99.2 C100.1 C101.1 C102.2 C103.1 C104.1 C105.2 C106.2 C107.2 C108.1 C109.1 C110.2 C111.1 C112.1 C113.2 C114.1 C115.1 C116.2 C117.1 C118.2 R158.2 R159.2 R160.2 R162.2 R181.2 R182.2 R183.2 R185.2 U10.43(CKXTAL2) U10.47(GND) U10.49(GND) U11.43(CKXTAL2) U11.47(GND) U11.49(GND) Y6.2(G) Y7.2(G)
IO34_14N: R140.2 R158.1 U10.13(RXCTL/AD2)  [also labelled P5_AD2]
IO34_14P: R156.1 U10.14(RXD0/SELRGV)  [also labelled P5_SELRGV]
IO35_3N: U11.23(TXD0)  [also labelled P6_TXD0]
IO35_3P: U11.25(TXD2)  [also labelled P6_TXD2]
IO35_5N: U11.24(TXD1)  [also labelled P6_TXD1]
IO35_5P: U11.22(TXC)  [also labelled P6_TXC]
IO35_6N: U11.19(RXC)  [also labelled P6_RXC]
IO35_6P: R177.1 U11.17(RXD2/AN0)  [also labelled P6_AN0]
IO35_7N: R154.1 U10.17(RXD2/AN0)  [also labelled P5_AN0]
IO35_7P: R152.1 U10.16(RXD1/TXDLY)  [also labelled P5_TXDLY]
IO35_9N: U10.19(RXC)  [also labelled P5_RXC]
IO35_9P: R155.1 U10.18(RXD3/AN1)  [also labelled P5_AN1]
IO35_14N: U10.23(TXD0)  [also labelled P5_TXD0]
IO35_14P: U10.22(TXC)  [also labelled P5_TXC]
IO35_15N: R173.1 U11.30(MDC)
IO35_15P: R174.1 U11.31(MDIO)
IO35_17N: R163.2 R181.1 U11.13(RXCTL/AD2)  [also labelled P6_AD2]
IO35_17P: R150.1 U10.30(MDC)
IO35_18N: U11.26(TXD3)  [also labelled P6_TXD3]
IO35_18P: U11.27(TXCTL)  [also labelled P6_TXCTL]
IO35_19N: R175.1 U11.16(RXD1/TXDLY)  [also labelled P6_TXDLY]
IO35_19P: R178.1 U11.18(RXD3/AN1)  [also labelled P6_AN1]
IO35_20N: R151.1 U10.31(MDIO)
IO35_20P: R179.1 U11.14(RXD0/SELRGV)  [also labelled P6_SELRGV]
IO35_22N: U10.26(TXD3)  [also labelled P5_TXD3]
IO35_22P: U10.27(TXCTL)  [also labelled P5_TXCTL]
IO35_23N: U10.25(TXD2)  [also labelled P5_TXD2]
IO35_23P: U10.24(TXD1)  [also labelled P5_TXD1]
LED5_GP: R141.2 R159.1 U10.35(LED1/AD1)  [also labelled P5_AD1]
LED5_YN: R142.2 R160.1 U10.34(LED0/AD0)  [also labelled P5_AD0]
LED6_GP: R164.2 R182.1 U11.35(LED1/AD1)  [also labelled P6_AD1]
LED6_YN: R165.2 R183.1 U11.34(LED0/AD0)  [also labelled P6_AD0]
MDI5_0_N: U10.2(MDI0-)
MDI5_0_P: U10.1(MDI0+)
MDI5_1_N: U10.5(MDI1-)
MDI5_1_P: U10.4(MDI1+)
MDI5_2_N: U10.8(MDI2-)
MDI5_2_P: U10.7(MDI2+)
MDI5_3_N: U10.11(MDI3-)
MDI5_3_P: U10.10(MDI3+)
MDI6_0_N: U11.2(MDI0-)
MDI6_0_P: U11.1(MDI0+)
MDI6_1_N: U11.5(MDI1-)
MDI6_1_P: U11.4(MDI1+)
MDI6_2_N: U11.8(MDI2-)
MDI6_2_P: U11.7(MDI2+)
MDI6_3_N: U11.11(MDI3-)
MDI6_3_P: U11.10(MDI3+)
P5_RXDLY: R153.1 U10.32(LED2/RXDLY)
P6_RXDLY: R176.1 U11.32(LED2/RXDLY)
PHY5_1V05: C103.2 FB17.1 FB18.1 L7.1
PHY5_1V05A: C95.2 C98.2 C101.2 FB18.2 U10.3(AVDD10) U10.9(AVDD10) U10.40(AVDD10)
PHY5_1V05D: C94.2 C97.2 C100.2 FB17.2 U10.28(DVDD10) U10.36(DVDD10)
PHY6_1V05: C117.2 FB20.1 FB21.1 L8.1
PHY6_1V05A: C109.2 C112.2 C115.2 FB21.2 U11.3(AVDD10) U11.9(AVDD10) U11.40(AVDD10)
PHY6_1V05D: C108.2 C111.2 C114.2 FB20.2 U11.28(DVDD10) U11.36(DVDD10)
PHYRST5: C90.1 R143.2 U10.29(PHYRSTB)
PHYRST6: C105.1 R166.2 U11.29(PHYRSTB)
NetC89_2: C89.2 FB16.1 Y6.4(V)
NetC104_2: C104.2 FB19.1 Y7.4(V)
NetL7_2: L7.2 U10.48(REG_OUT)
NetL8_2: L8.2 U11.48(REG_OUT)
NetR157_1: R157.1 U10.42(CKXTAL1)
NetR157_2: R157.2 Y6.3(OP)
NetR161_1: R161.1 U10.38(ENSWREG)
NetR162_1: R162.1 U10.39(RSET)
NetR180_1: R180.1 U11.42(CKXTAL1)
NetR180_2: R180.2 Y7.3(OP)
NetR184_1: R184.1 U11.38(ENSWREG)
NetR185_1: R185.1 U11.39(RSET)

Not connected (* = marked no-connect by the designer): U10 12(NC)* 20(INTB)* 33(PMEB)* 46(CLK125)*; U11 12(NC)* 20(INTB)* 33(PMEB)* 46(CLK125)*; Y6 1(EC)*; Y7 1(EC)*

### Layout directives
differential pair: MDI5_0_N, MDI5_0_P, MDI5_1_N, MDI5_1_P, MDI5_2_N, MDI5_2_P, MDI5_3_N, MDI5_3_P, MDI6_0_N, MDI6_0_P, MDI6_1_N, MDI6_1_P, MDI6_2_N, MDI6_2_P, MDI6_3_N, MDI6_3_P

### Notes on the sheet
- PHY地址配置，默认001
- 总线3 A路
- 总线3 B路

### Library data of the parts
C89-C118 = CAP_0402: 贴片电容 0402
FB16 FB19 = FB_0402: 磁珠 0402
FB17 FB18 FB20 FB21 = FB_0603: 磁珠 0603
L7 L8 = L_0805: 电感 0805
R140-R143 R150-R166 R173-R185 = RES_0402: 电阻 0402
U10 U11 = RTL8211E: QFN48
Y6 Y7 = XTAL_3225

## Sheet OECU_BASE6.SchDoc
size A4; SheetNumber: 6; SheetTotal: 6
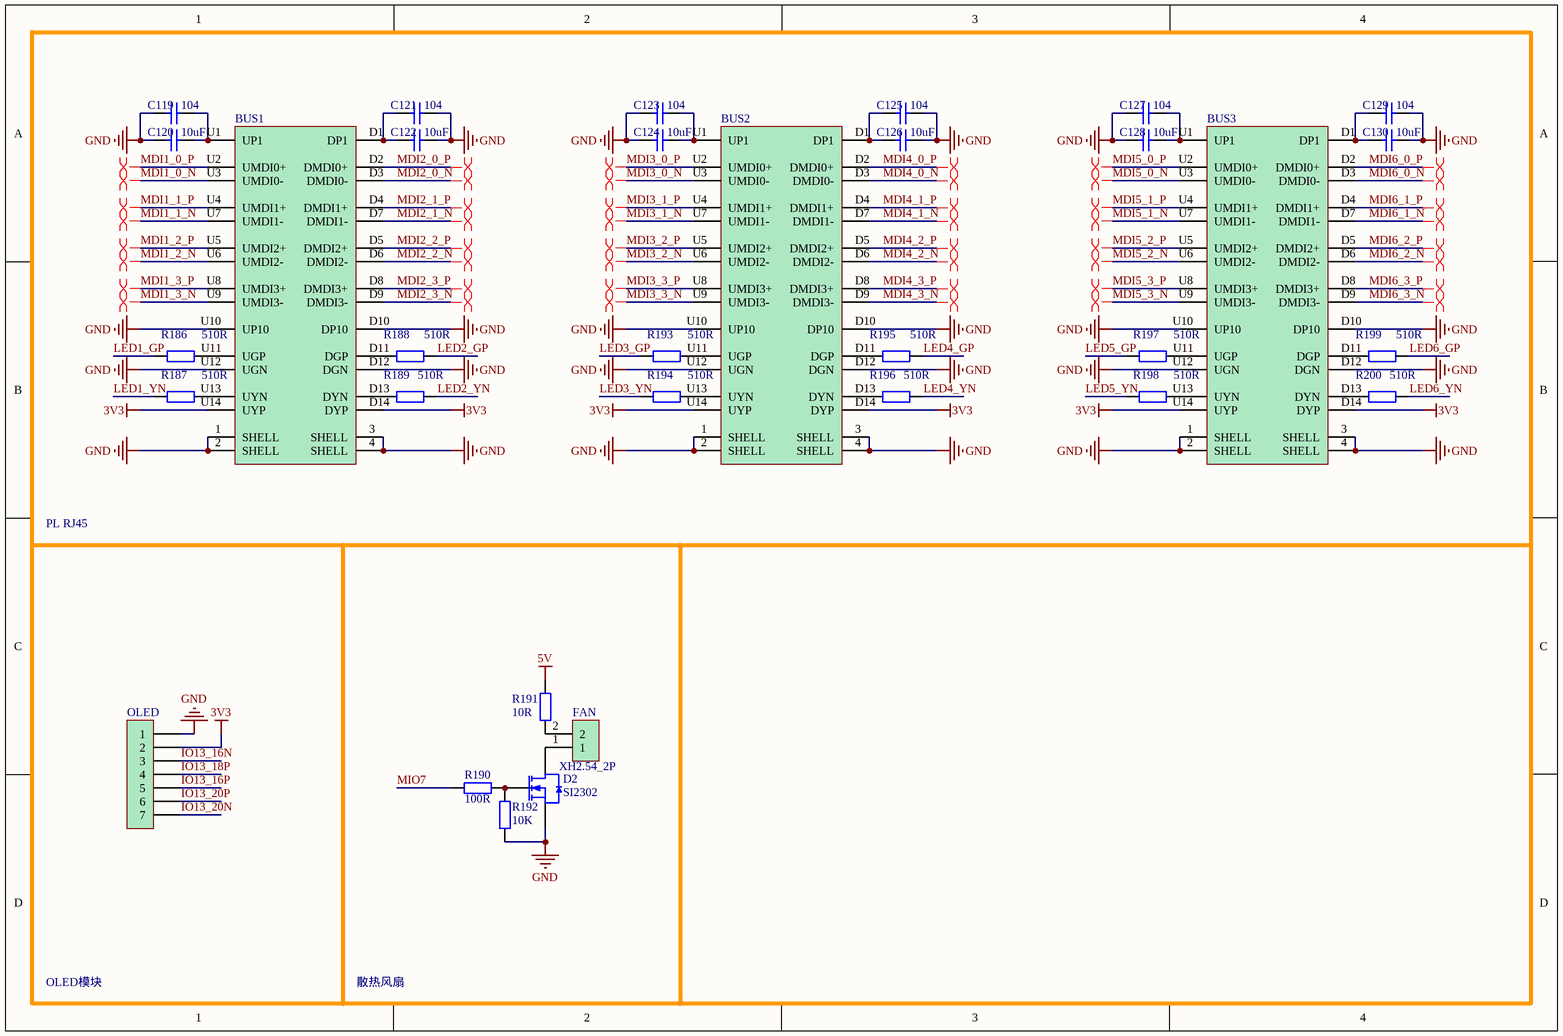
[diagram p5: OECU_BASE6.SchDoc]

### Parts
BUS1  RJ45_HR916130H  [HR916130H]  (value not drawn)
BUS2  RJ45_HR916130H  [HR916130H]  (value not drawn)
BUS3  RJ45_HR916130H  [HR916130H]  (value not drawn)
C119  104  [0402]
C120  10uF  [0402]
C121  104  [0402]
C122  10uF  [0402]
C123  104  [0402]
C124  10uF  [0402]
C125  104  [0402]
C126  10uF  [0402]
C127  104  [0402]
C128  10uF  [0402]
C129  104  [0402]
C130  10uF  [0402]
D2  SI2302  [SOT23]
FAN  XH2.54_2P  [XH2.5_2P]
OLED  Header_2.54_7P  [HDR1_7P]  (value not drawn)
R186  510R  [R_0402]
R187  510R  [R_0402]
R188  510R  [R_0402]
R189  510R  [R_0402]
R190  100R  [R_0402]
R191  10R  [R_0402]
R192  10K  [R_0402]
R193  510R  [R_0402]
R194  510R  [R_0402]
R195  510R  [R_0402]
R196  510R  [R_0402]
R197  510R  [R_0402]
R198  510R  [R_0402]
R199  510R  [R_0402]
R200  510R  [R_0402]

### Nets
3V3: BUS1.D14(DYP) BUS1.U14(UYP) BUS2.D14(DYP) BUS2.U14(UYP) BUS3.D14(DYP) BUS3.U14(UYP) OLED.2
5V: R191.1
GND: BUS1.1(SHELL) BUS1.2(SHELL) BUS1.3(SHELL) BUS1.4(SHELL) BUS1.D10(DP10) BUS1.D12(DGN) BUS1.U10(UP10) BUS1.U12(UGN) BUS2.1(SHELL) BUS2.2(SHELL) BUS2.3(SHELL) BUS2.4(SHELL) BUS2.D10(DP10) BUS2.D12(DGN) BUS2.U10(UP10) BUS2.U12(UGN) BUS3.1(SHELL) BUS3.2(SHELL) BUS3.3(SHELL) BUS3.4(SHELL) BUS3.D10(DP10) BUS3.D12(DGN) BUS3.U10(UP10) BUS3.U12(UGN) C119.1 C120.1 C121.1 C122.1 C123.1 C124.1 C125.1 C126.1 C127.1 C128.1 C129.1 C130.1 D2.2(S) OLED.1 R192.2
IO13_16N: OLED.3
IO13_16P: OLED.5
IO13_18P: OLED.4
IO13_20N: OLED.7
IO13_20P: OLED.6
LED1_GP: R186.1
LED1_YN: R187.1
LED2_GP: R188.2
LED2_YN: R189.1
LED3_GP: R193.1
LED3_YN: R194.1
LED4_GP: R195.2
LED4_YN: R196.1
LED5_GP: R197.1
LED5_YN: R198.1
LED6_GP: R199.2
LED6_YN: R200.1
MDI1_0_N: BUS1.U3(UMDI0-)
MDI1_0_P: BUS1.U2(UMDI0+)
MDI1_1_N: BUS1.U7(UMDI1-)
MDI1_1_P: BUS1.U4(UMDI1+)
MDI1_2_N: BUS1.U6(UMDI2-)
MDI1_2_P: BUS1.U5(UMDI2+)
MDI1_3_N: BUS1.U9(UMDI3-)
MDI1_3_P: BUS1.U8(UMDI3+)
MDI2_0_N: BUS1.D3(DMDI0-)
MDI2_0_P: BUS1.D2(DMDI0+)
MDI2_1_N: BUS1.D7(DMDI1-)
MDI2_1_P: BUS1.D4(DMDI1+)
MDI2_2_N: BUS1.D6(DMDI2-)
MDI2_2_P: BUS1.D5(DMDI2+)
MDI2_3_N: BUS1.D9(DMDI3-)
MDI2_3_P: BUS1.D8(DMDI3+)
MDI3_0_N: BUS2.U3(UMDI0-)
MDI3_0_P: BUS2.U2(UMDI0+)
MDI3_1_N: BUS2.U7(UMDI1-)
MDI3_1_P: BUS2.U4(UMDI1+)
MDI3_2_N: BUS2.U6(UMDI2-)
MDI3_2_P: BUS2.U5(UMDI2+)
MDI3_3_N: BUS2.U9(UMDI3-)
MDI3_3_P: BUS2.U8(UMDI3+)
MDI4_0_N: BUS2.D3(DMDI0-)
MDI4_0_P: BUS2.D2(DMDI0+)
MDI4_1_N: BUS2.D7(DMDI1-)
MDI4_1_P: BUS2.D4(DMDI1+)
MDI4_2_N: BUS2.D6(DMDI2-)
MDI4_2_P: BUS2.D5(DMDI2+)
MDI4_3_N: BUS2.D9(DMDI3-)
MDI4_3_P: BUS2.D8(DMDI3+)
MDI5_0_N: BUS3.U3(UMDI0-)
MDI5_0_P: BUS3.U2(UMDI0+)
MDI5_1_N: BUS3.U7(UMDI1-)
MDI5_1_P: BUS3.U4(UMDI1+)
MDI5_2_N: BUS3.U6(UMDI2-)
MDI5_2_P: BUS3.U5(UMDI2+)
MDI5_3_N: BUS3.U9(UMDI3-)
MDI5_3_P: BUS3.U8(UMDI3+)
MDI6_0_N: BUS3.D3(DMDI0-)
MDI6_0_P: BUS3.D2(DMDI0+)
MDI6_1_N: BUS3.D7(DMDI1-)
MDI6_1_P: BUS3.D4(DMDI1+)
MDI6_2_N: BUS3.D6(DMDI2-)
MDI6_2_P: BUS3.D5(DMDI2+)
MDI6_3_N: BUS3.D9(DMDI3-)
MDI6_3_P: BUS3.D8(DMDI3+)
MIO7: R190.1
NetBUS1_D1: BUS1.D1(DP1) C121.2 C122.2
NetBUS1_D11: BUS1.D11(DGP) R188.1
NetBUS1_D13: BUS1.D13(DYN) R189.2
NetBUS1_U1: BUS1.U1(UP1) C119.2 C120.2
NetBUS1_U11: BUS1.U11(UGP) R186.2
NetBUS1_U13: BUS1.U13(UYN) R187.2
NetBUS2_D1: BUS2.D1(DP1) C125.2 C126.2
NetBUS2_D11: BUS2.D11(DGP) R195.1
NetBUS2_D13: BUS2.D13(DYN) R196.2
NetBUS2_U1: BUS2.U1(UP1) C123.2 C124.2
NetBUS2_U11: BUS2.U11(UGP) R193.2
NetBUS2_U13: BUS2.U13(UYN) R194.2
NetBUS3_D1: BUS3.D1(DP1) C129.2 C130.2
NetBUS3_D11: BUS3.D11(DGP) R199.1
NetBUS3_D13: BUS3.D13(DYN) R200.2
NetBUS3_U1: BUS3.U1(UP1) C127.2 C128.2
NetBUS3_U11: BUS3.U11(UGP) R197.2
NetBUS3_U13: BUS3.U13(UYN) R198.2
NetD2_1: D2.1(G) R190.2 R192.1
NetD2_3: D2.3(D) FAN.1
NetFAN_2: FAN.2 R191.2

### Layout directives
differential pair: MDI1_0_N, MDI1_0_P, MDI1_1_N, MDI1_1_P, MDI1_2_N, MDI1_2_P, MDI1_3_N, MDI1_3_P, MDI2_0_N, MDI2_0_P, MDI2_1_N, MDI2_1_P, MDI2_2_N, MDI2_2_P, MDI2_3_N, MDI2_3_P, MDI3_0_N, MDI3_0_P, MDI3_1_N, MDI3_1_P, MDI3_2_N, MDI3_2_P, MDI3_3_N, MDI3_3_P, MDI4_0_N, MDI4_0_P, MDI4_1_N, MDI4_1_P, MDI4_2_N, MDI4_2_P, MDI4_3_N, MDI4_3_P, MDI5_0_N, MDI5_0_P, MDI5_1_N, MDI5_1_P, MDI5_2_N, MDI5_2_P, MDI5_3_N, MDI5_3_P, MDI6_0_N, MDI6_0_P, MDI6_1_N, MDI6_1_P, MDI6_2_N, MDI6_2_P, MDI6_3_N, MDI6_3_P

### Notes on the sheet
- PL RJ45
- OLED模块
- 散热风扇

### Library data of the parts
C119-C130 = CAP_0402: 贴片电容 0402
D2 = MOSN_SI2302_SOT23: NMOS
R186-R200 = RES_0402: 电阻 0402

## Nets that join several sheets
1V8: OECU_BASE1 (6 pins), OECU_BASE2 (10 pins)
3V3: OECU_BASE1 (21 pins), OECU_BASE2 (18 pins), OECU_BASE3 (52 pins), OECU_BASE4 (52 pins), OECU_BASE5 (52 pins), OECU_BASE6 (7 pins)
5V: OECU_BASE1 (13 pins), OECU_BASE2 (H1.20 H2.20), OECU_BASE6 (R191.1)
GND: OECU_BASE1 (62 pins), OECU_BASE2 (36 pins), OECU_BASE3 (46 pins), OECU_BASE4 (46 pins), OECU_BASE5 (46 pins), OECU_BASE6 (39 pins)
IO13_11N: OECU_BASE1 (M1.78), OECU_BASE2 (H1.6)
IO13_11P: OECU_BASE1 (M1.76), OECU_BASE2 (H1.7)
IO13_12N: OECU_BASE1 (M1.50), OECU_BASE2 (H2.1)
IO13_12P: OECU_BASE1 (M1.52), OECU_BASE2 (H1.9)
IO13_13N: OECU_BASE1 (M1.75), OECU_BASE2 (H1.17)
IO13_13P: OECU_BASE1 (M1.77), OECU_BASE2 (H1.16)
IO13_14N: OECU_BASE1 (M1.79), OECU_BASE2 (H1.15)
IO13_14P: OECU_BASE1 (M1.81), OECU_BASE2 (H1.14)
IO13_15N: OECU_BASE1 (M1.80), OECU_BASE2 (H1.5)
IO13_15P: OECU_BASE1 (M1.82), OECU_BASE2 (H1.4)
IO13_16N: OECU_BASE1 (M1.84), OECU_BASE6 (OLED.3)
IO13_16P: OECU_BASE1 (M1.86), OECU_BASE6 (OLED.5)
IO13_17N: OECU_BASE1 (M1.45), OECU_BASE2 (H2.13)
IO13_17P: OECU_BASE1 (M1.47), OECU_BASE2 (H2.12)
IO13_18P: OECU_BASE1 (M1.85), OECU_BASE6 (OLED.4)
IO13_19N: OECU_BASE1 (M1.46), OECU_BASE2 (H2.3)
IO13_19P: OECU_BASE1 (M1.48), OECU_BASE2 (H2.2)
IO13_20N: OECU_BASE1 (M1.89), OECU_BASE6 (OLED.7)
IO13_20P: OECU_BASE1 (M1.87), OECU_BASE6 (OLED.6)
IO13_21N: OECU_BASE1 (M1.49), OECU_BASE2 (H2.11)
IO13_21P: OECU_BASE1 (M1.51), OECU_BASE2 (H1.19)
IO13_22N: OECU_BASE1 (M1.72), OECU_BASE2 (H1.8)
IO13_22P: OECU_BASE1 (M1.70), OECU_BASE2 (H1.18)
IO34_1N: OECU_BASE1 (M1.88), OECU_BASE3 (R58.1 U6.30)
IO34_1P: OECU_BASE1 (M1.90), OECU_BASE3 (R59.1 U6.31)
IO34_2N: OECU_BASE1 (M1.63), OECU_BASE3 (U6.23)
IO34_2P: OECU_BASE1 (M1.61), OECU_BASE3 (U6.22)
IO34_4N: OECU_BASE1 (M1.96), OECU_BASE3 (U7.22)
IO34_4P: OECU_BASE1 (M1.94), OECU_BASE3 (U6.27)
IO34_5N: OECU_BASE1 (M1.58), OECU_BASE3 (R48.2 R66.1 U6.13)
IO34_5P: OECU_BASE1 (M1.60), OECU_BASE3 (R64.1 U6.14)
IO34_6N: OECU_BASE1 (M1.67), OECU_BASE3 (U6.25)
IO34_6P: OECU_BASE1 (M1.65), OECU_BASE3 (U6.24)
IO34_7N: OECU_BASE1 (M1.99), OECU_BASE3 (R83.1 U7.16)
IO34_7P: OECU_BASE1 (M1.97), OECU_BASE3 (R87.1 U7.14)
IO34_8N: OECU_BASE1 (M1.93), OECU_BASE3 (U6.26)
IO34_8P: OECU_BASE1 (M1.95), OECU_BASE3 (R71.2 R89.1 U7.13)
IO34_9N: OECU_BASE1 (M1.113), OECU_BASE3 (R82.1 U7.31)
IO34_9P: OECU_BASE1 (M1.111), OECU_BASE3 (R81.1 U7.30)
IO34_10N: OECU_BASE1 (M1.118), OECU_BASE4 (U9.23)
IO34_10P: OECU_BASE1 (M1.116), OECU_BASE4 (U9.22)
IO34_11N: OECU_BASE1 (M1.107), OECU_BASE3 (U7.27)
IO34_11P: OECU_BASE1 (M1.105), OECU_BASE3 (U7.19)
IO34_13N: OECU_BASE1 (M1.106), OECU_BASE3 (U7.25)
IO34_13P: OECU_BASE1 (M1.108), OECU_BASE3 (U7.26)
IO34_14N: OECU_BASE1 (M1.143), OECU_BASE5 (R140.2 R158.1 U10.13)
IO34_14P: OECU_BASE1 (M1.145), OECU_BASE5 (R156.1 U10.14)
IO34_15N: OECU_BASE1 (M1.137), OECU_BASE4 (R127.1 U9.30)
IO34_15P: OECU_BASE1 (M1.139), OECU_BASE4 (R128.1 U9.31)
IO34_16N: OECU_BASE1 (M1.133), OECU_BASE4 (R132.1 U9.18)
IO34_16P: OECU_BASE1 (M1.135), OECU_BASE4 (U9.19)
IO34_17N: OECU_BASE1 (M1.131), OECU_BASE4 (R131.1 U9.17)
IO34_17P: OECU_BASE1 (M1.129), OECU_BASE4 (R129.1 U9.16)
IO34_18N: OECU_BASE1 (M1.132), OECU_BASE4 (U9.25)
IO34_18P: OECU_BASE1 (M1.130), OECU_BASE4 (U9.24)
IO34_19N: OECU_BASE1 (M1.104), OECU_BASE3 (U7.24)
IO34_19P: OECU_BASE1 (M1.102), OECU_BASE3 (U7.23)
IO34_20N: OECU_BASE1 (M1.66), OECU_BASE3 (R63.1 U6.18)
IO34_20P: OECU_BASE1 (M1.68), OECU_BASE3 (U6.19)
IO34_21N: OECU_BASE1 (M1.136), OECU_BASE4 (U9.27)
IO34_21P: OECU_BASE1 (M1.134), OECU_BASE4 (U9.26)
IO34_22N: OECU_BASE1 (M1.117), OECU_BASE4 (R133.1 U9.14)
IO34_22P: OECU_BASE1 (M1.115), OECU_BASE4 (R117.2 R135.1 U9.13)
IO34_23N: OECU_BASE1 (M1.101), OECU_BASE3 (R85.1 U7.17)
IO34_23P: OECU_BASE1 (M1.103), OECU_BASE3 (R86.1 U7.18)
IO34_24N: OECU_BASE1 (M1.62), OECU_BASE3 (R60.1 U6.16)
IO34_24P: OECU_BASE1 (M1.64), OECU_BASE3 (R62.1 U6.17)
IO35_3N: OECU_BASE1 (M1.166), OECU_BASE5 (U11.23)
IO35_3P: OECU_BASE1 (M1.168), OECU_BASE5 (U11.25)
IO35_5N: OECU_BASE1 (M1.167), OECU_BASE5 (U11.24)
IO35_5P: OECU_BASE1 (M1.165), OECU_BASE5 (U11.22)
IO35_6N: OECU_BASE1 (M1.164), OECU_BASE5 (U11.19)
IO35_6P: OECU_BASE1 (M1.162), OECU_BASE5 (R177.1 U11.17)
IO35_7N: OECU_BASE1 (M1.149), OECU_BASE5 (R154.1 U10.17)
IO35_7P: OECU_BASE1 (M1.147), OECU_BASE5 (R152.1 U10.16)
IO35_8N: OECU_BASE1 (M1.71), OECU_BASE4 (R108.1 U8.17)
IO35_8P: OECU_BASE1 (M1.69), OECU_BASE4 (R106.1 U8.16)
IO35_9N: OECU_BASE1 (M1.153), OECU_BASE5 (U10.19)
IO35_9P: OECU_BASE1 (M1.151), OECU_BASE5 (R155.1 U10.18)
IO35_10N: OECU_BASE1 (M1.140), OECU_BASE4 (R105.1 U8.31)
IO35_10P: OECU_BASE1 (M1.138), OECU_BASE4 (R104.1 U8.30)
IO35_11N: OECU_BASE1 (M1.114), OECU_BASE4 (U8.23)
IO35_11P: OECU_BASE1 (M1.112), OECU_BASE4 (U8.22)
IO35_12N: OECU_BASE1 (M1.126), OECU_BASE4 (U8.27)
IO35_12P: OECU_BASE1 (M1.124), OECU_BASE4 (U8.26)
IO35_13N: OECU_BASE1 (M1.59), OECU_BASE4 (R110.1 U8.14)
IO35_13P: OECU_BASE1 (M1.57), OECU_BASE4 (R94.2 R112.1 U8.13)
IO35_14N: OECU_BASE1 (M1.146), OECU_BASE5 (U10.23)
IO35_14P: OECU_BASE1 (M1.144), OECU_BASE5 (U10.22)
IO35_15N: OECU_BASE1 (M1.199), OECU_BASE5 (R173.1 U11.30)
IO35_15P: OECU_BASE1 (M1.201), OECU_BASE5 (R174.1 U11.31)
IO35_17N: OECU_BASE1 (M1.159), OECU_BASE5 (R163.2 R181.1 U11.13)
IO35_17P: OECU_BASE1 (M1.157), OECU_BASE5 (R150.1 U10.30)
IO35_18N: OECU_BASE1 (M1.195), OECU_BASE5 (U11.26)
IO35_18P: OECU_BASE1 (M1.197), OECU_BASE5 (U11.27)
IO35_19N: OECU_BASE1 (M1.161), OECU_BASE5 (R175.1 U11.16)
IO35_19P: OECU_BASE1 (M1.163), OECU_BASE5 (R178.1 U11.18)
IO35_20N: OECU_BASE1 (M1.158), OECU_BASE5 (R151.1 U10.31)
IO35_20P: OECU_BASE1 (M1.160), OECU_BASE5 (R179.1 U11.14)
IO35_21N: OECU_BASE1 (M1.100), OECU_BASE4 (U8.19)
IO35_21P: OECU_BASE1 (M1.98), OECU_BASE4 (R109.1 U8.18)
IO35_22N: OECU_BASE1 (M1.152), OECU_BASE5 (U10.26)
IO35_22P: OECU_BASE1 (M1.154), OECU_BASE5 (U10.27)
IO35_23N: OECU_BASE1 (M1.150), OECU_BASE5 (U10.25)
IO35_23P: OECU_BASE1 (M1.148), OECU_BASE5 (U10.24)
IO35_24N: OECU_BASE1 (M1.122), OECU_BASE4 (U8.25)
IO35_24P: OECU_BASE1 (M1.120), OECU_BASE4 (U8.24)
J_TCK: OECU_BASE1 (M1.27), OECU_BASE2 (JTAG.2)
J_TDI: OECU_BASE1 (M1.23), OECU_BASE2 (JTAG.5)
J_TDO: OECU_BASE1 (M1.25), OECU_BASE2 (JTAG.3)
J_TMS: OECU_BASE1 (M1.21), OECU_BASE2 (JTAG.4)
LED1_GP: OECU_BASE3 (R49.2 R67.1 U6.35), OECU_BASE6 (R186.1)
LED1_YN: OECU_BASE3 (R50.2 R68.1 U6.34), OECU_BASE6 (R187.1)
LED2_GP: OECU_BASE3 (R72.2 R90.1 U7.35), OECU_BASE6 (R188.2)
LED2_YN: OECU_BASE3 (R73.2 R91.1 U7.34), OECU_BASE6 (R189.1)
LED3_GP: OECU_BASE4 (R95.2 R113.1 U8.35), OECU_BASE6 (R193.1)
LED3_YN: OECU_BASE4 (R96.2 R114.1 U8.34), OECU_BASE6 (R194.1)
LED4_GP: OECU_BASE4 (R118.2 R136.1 U9.35), OECU_BASE6 (R195.2)
LED4_YN: OECU_BASE4 (R119.2 R137.1 U9.34), OECU_BASE6 (R196.1)
LED5_GP: OECU_BASE5 (R141.2 R159.1 U10.35), OECU_BASE6 (R197.1)
LED5_YN: OECU_BASE5 (R142.2 R160.1 U10.34), OECU_BASE6 (R198.1)
LED6_GP: OECU_BASE5 (R164.2 R182.1 U11.35), OECU_BASE6 (R199.2)
LED6_YN: OECU_BASE5 (R165.2 R183.1 U11.34), OECU_BASE6 (R200.1)
MDI1_0_N: OECU_BASE3 (U6.2), OECU_BASE6 (BUS1.U3)
MDI1_0_P: OECU_BASE3 (U6.1), OECU_BASE6 (BUS1.U2)
MDI1_1_N: OECU_BASE3 (U6.5), OECU_BASE6 (BUS1.U7)
MDI1_1_P: OECU_BASE3 (U6.4), OECU_BASE6 (BUS1.U4)
MDI1_2_N: OECU_BASE3 (U6.8), OECU_BASE6 (BUS1.U6)
MDI1_2_P: OECU_BASE3 (U6.7), OECU_BASE6 (BUS1.U5)
MDI1_3_N: OECU_BASE3 (U6.11), OECU_BASE6 (BUS1.U9)
MDI1_3_P: OECU_BASE3 (U6.10), OECU_BASE6 (BUS1.U8)
MDI2_0_N: OECU_BASE3 (U7.2), OECU_BASE6 (BUS1.D3)
MDI2_0_P: OECU_BASE3 (U7.1), OECU_BASE6 (BUS1.D2)
MDI2_1_N: OECU_BASE3 (U7.5), OECU_BASE6 (BUS1.D7)
MDI2_1_P: OECU_BASE3 (U7.4), OECU_BASE6 (BUS1.D4)
MDI2_2_N: OECU_BASE3 (U7.8), OECU_BASE6 (BUS1.D6)
MDI2_2_P: OECU_BASE3 (U7.7), OECU_BASE6 (BUS1.D5)
MDI2_3_N: OECU_BASE3 (U7.11), OECU_BASE6 (BUS1.D9)
MDI2_3_P: OECU_BASE3 (U7.10), OECU_BASE6 (BUS1.D8)
MDI3_0_N: OECU_BASE4 (U8.2), OECU_BASE6 (BUS2.U3)
MDI3_0_P: OECU_BASE4 (U8.1), OECU_BASE6 (BUS2.U2)
MDI3_1_N: OECU_BASE4 (U8.5), OECU_BASE6 (BUS2.U7)
MDI3_1_P: OECU_BASE4 (U8.4), OECU_BASE6 (BUS2.U4)
MDI3_2_N: OECU_BASE4 (U8.8), OECU_BASE6 (BUS2.U6)
MDI3_2_P: OECU_BASE4 (U8.7), OECU_BASE6 (BUS2.U5)
MDI3_3_N: OECU_BASE4 (U8.11), OECU_BASE6 (BUS2.U9)
MDI3_3_P: OECU_BASE4 (U8.10), OECU_BASE6 (BUS2.U8)
MDI4_0_N: OECU_BASE4 (U9.2), OECU_BASE6 (BUS2.D3)
MDI4_0_P: OECU_BASE4 (U9.1), OECU_BASE6 (BUS2.D2)
MDI4_1_N: OECU_BASE4 (U9.5), OECU_BASE6 (BUS2.D7)
MDI4_1_P: OECU_BASE4 (U9.4), OECU_BASE6 (BUS2.D4)
MDI4_2_N: OECU_BASE4 (U9.8), OECU_BASE6 (BUS2.D6)
MDI4_2_P: OECU_BASE4 (U9.7), OECU_BASE6 (BUS2.D5)
MDI4_3_N: OECU_BASE4 (U9.11), OECU_BASE6 (BUS2.D9)
MDI4_3_P: OECU_BASE4 (U9.10), OECU_BASE6 (BUS2.D8)
MDI5_0_N: OECU_BASE5 (U10.2), OECU_BASE6 (BUS3.U3)
MDI5_0_P: OECU_BASE5 (U10.1), OECU_BASE6 (BUS3.U2)
MDI5_1_N: OECU_BASE5 (U10.5), OECU_BASE6 (BUS3.U7)
MDI5_1_P: OECU_BASE5 (U10.4), OECU_BASE6 (BUS3.U4)
MDI5_2_N: OECU_BASE5 (U10.8), OECU_BASE6 (BUS3.U6)
MDI5_2_P: OECU_BASE5 (U10.7), OECU_BASE6 (BUS3.U5)
MDI5_3_N: OECU_BASE5 (U10.11), OECU_BASE6 (BUS3.U9)
MDI5_3_P: OECU_BASE5 (U10.10), OECU_BASE6 (BUS3.U8)
MDI6_0_N: OECU_BASE5 (U11.2), OECU_BASE6 (BUS3.D3)
MDI6_0_P: OECU_BASE5 (U11.1), OECU_BASE6 (BUS3.D2)
MDI6_1_N: OECU_BASE5 (U11.5), OECU_BASE6 (BUS3.D7)
MDI6_1_P: OECU_BASE5 (U11.4), OECU_BASE6 (BUS3.D4)
MDI6_2_N: OECU_BASE5 (U11.8), OECU_BASE6 (BUS3.D6)
MDI6_2_P: OECU_BASE5 (U11.7), OECU_BASE6 (BUS3.D5)
MDI6_3_N: OECU_BASE5 (U11.11), OECU_BASE6 (BUS3.D9)
MDI6_3_P: OECU_BASE5 (U11.10), OECU_BASE6 (BUS3.D8)
MIO7: OECU_BASE1 (M1.24), OECU_BASE6 (R190.1)
MIO8: OECU_BASE1 (M1.17), OECU_BASE2 (JTAG.6)
MIO9: OECU_BASE1 (M1.22), OECU_BASE2 (JTAG.7)
MIO16: OECU_BASE1 (M1.176), OECU_BASE2 (U5.22)
MIO17: OECU_BASE1 (M1.171), OECU_BASE2 (U5.23)
MIO18: OECU_BASE1 (M1.175), OECU_BASE2 (U5.24)
MIO19: OECU_BASE1 (M1.177), OECU_BASE2 (U5.25)
MIO20: OECU_BASE1 (M1.179), OECU_BASE2 (U5.26)
MIO21: OECU_BASE1 (M1.172), OECU_BASE2 (U5.27)
MIO22: OECU_BASE1 (M1.181), OECU_BASE2 (U5.19)
MIO23: OECU_BASE1 (M1.178), OECU_BASE2 (R42.1 U5.14)
MIO24: OECU_BASE1 (M1.180), OECU_BASE2 (R38.1 U5.16)
MIO25: OECU_BASE1 (M1.170), OECU_BASE2 (R40.1 U5.17)
MIO26: OECU_BASE1 (M1.182), OECU_BASE2 (R41.1 U5.18)
MIO27: OECU_BASE1 (M1.169), OECU_BASE2 (R35.2 R45.1 U5.13)
MIO28: OECU_BASE1 (M1.42), OECU_BASE2 (H2.5)
MIO29: OECU_BASE1 (M1.36), OECU_BASE2 (H2.7)
MIO30: OECU_BASE1 (M1.44), OECU_BASE2 (H2.4)
MIO31: OECU_BASE1 (M1.41), OECU_BASE2 (H2.14)
MIO32: OECU_BASE1 (M1.34), OECU_BASE2 (H2.8)
MIO33: OECU_BASE1 (M1.31), OECU_BASE2 (H2.18)
MIO34: OECU_BASE1 (M1.32), OECU_BASE2 (H2.9)
MIO35: OECU_BASE1 (M1.39), OECU_BASE2 (H2.15)
MIO36: OECU_BASE1 (M1.29), OECU_BASE2 (H2.19)
MIO37: OECU_BASE1 (M1.35), OECU_BASE2 (H2.16)
MIO38: OECU_BASE1 (M1.33), OECU_BASE2 (H2.17)
MIO39: OECU_BASE1 (M1.40), OECU_BASE2 (H2.6)
MIO46: OECU_BASE1 (M1.185), OECU_BASE2 (H1.13)
MIO47: OECU_BASE1 (M1.190), OECU_BASE2 (H1.3)
MIO48: OECU_BASE1 (M1.194), OECU_BASE2 (H1.1)
MIO49: OECU_BASE1 (M1.191), OECU_BASE2 (H1.12)
MIO50: OECU_BASE1 (M1.192), OECU_BASE2 (H1.2)
MIO51: OECU_BASE1 (M1.202), OECU_BASE2 (H1.11)
MIO52: OECU_BASE1 (M1.196), OECU_BASE2 (R29.1 U5.30)
MIO53: OECU_BASE1 (M1.198), OECU_BASE2 (R30.1 U5.31)